# EAGLE design Backplane (EAGLE 9.5.1)
DESIGNER: Hendrik Melse; PART_NUMBER: 68-0005; PROJECT: CougSat-1: Backplane; REV: 3.2.1

## Sheet 1 of 5
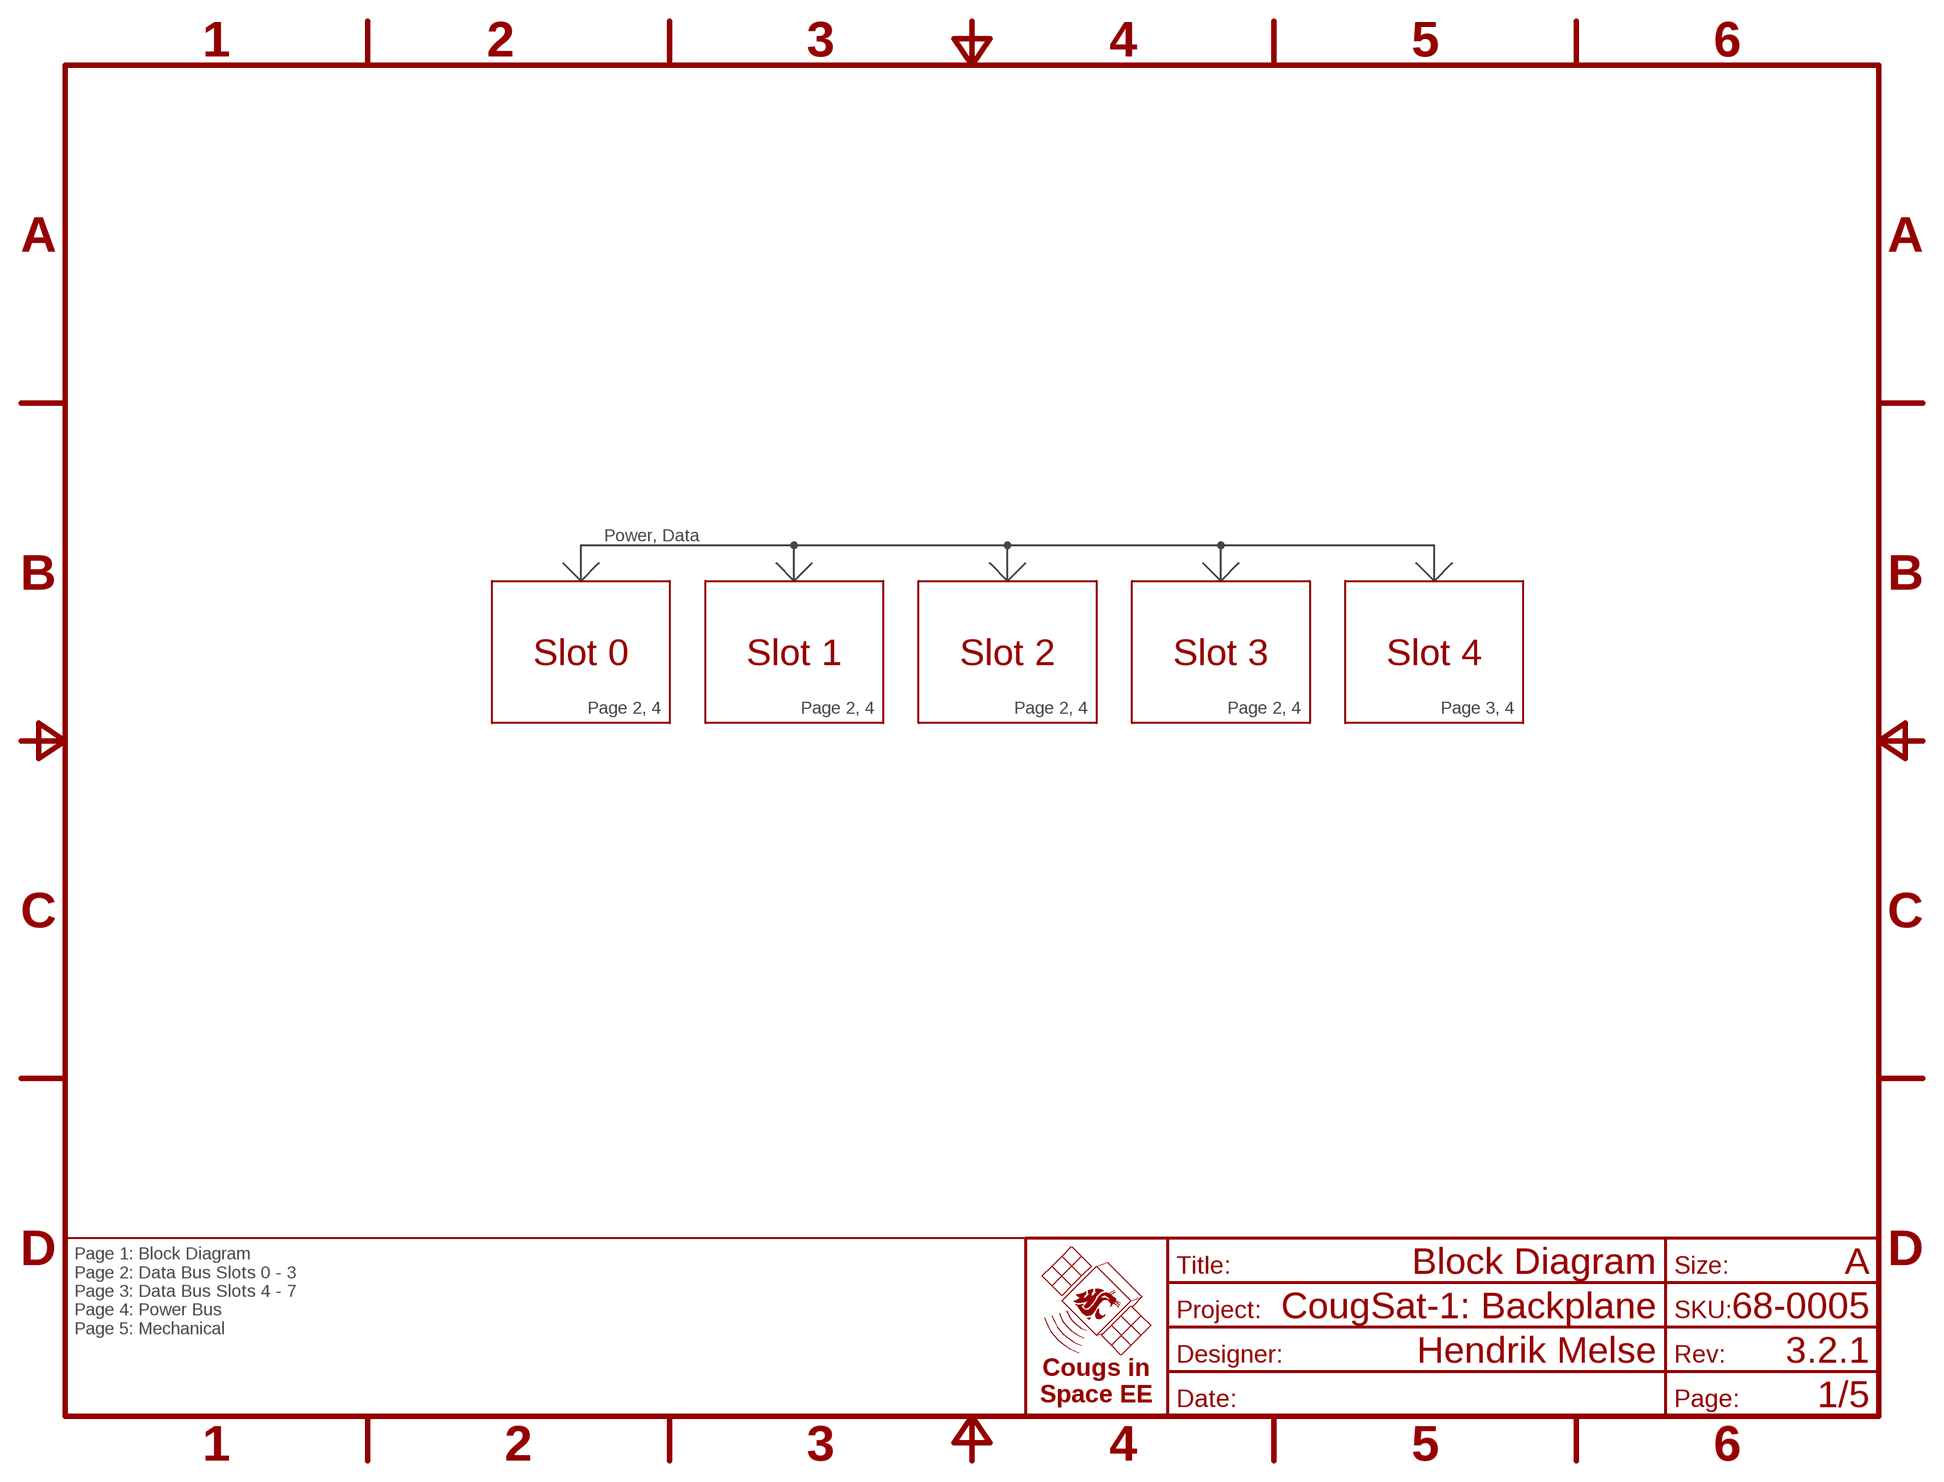
[diagram p0: schematic, sheet 1]
FRAME2 (FRAME-A): TITLE: Block Diagram

### Notes on the sheet
- Power, Data
- Slot 0 | Slot 1 | Slot 2 | Slot 3 | Slot 4
- Page 2, 4 | Page 2, 4 | Page 2, 4 | Page 2, 4 | Page 3, 4
- Page 1: Block Diagram
  Page 2: Data Bus Slots 0 - 3
  Page 3: Data Bus Slots 4 - 7
  Page 4: Power Bus
  Page 5: Mechanical

## Sheet 2 of 5
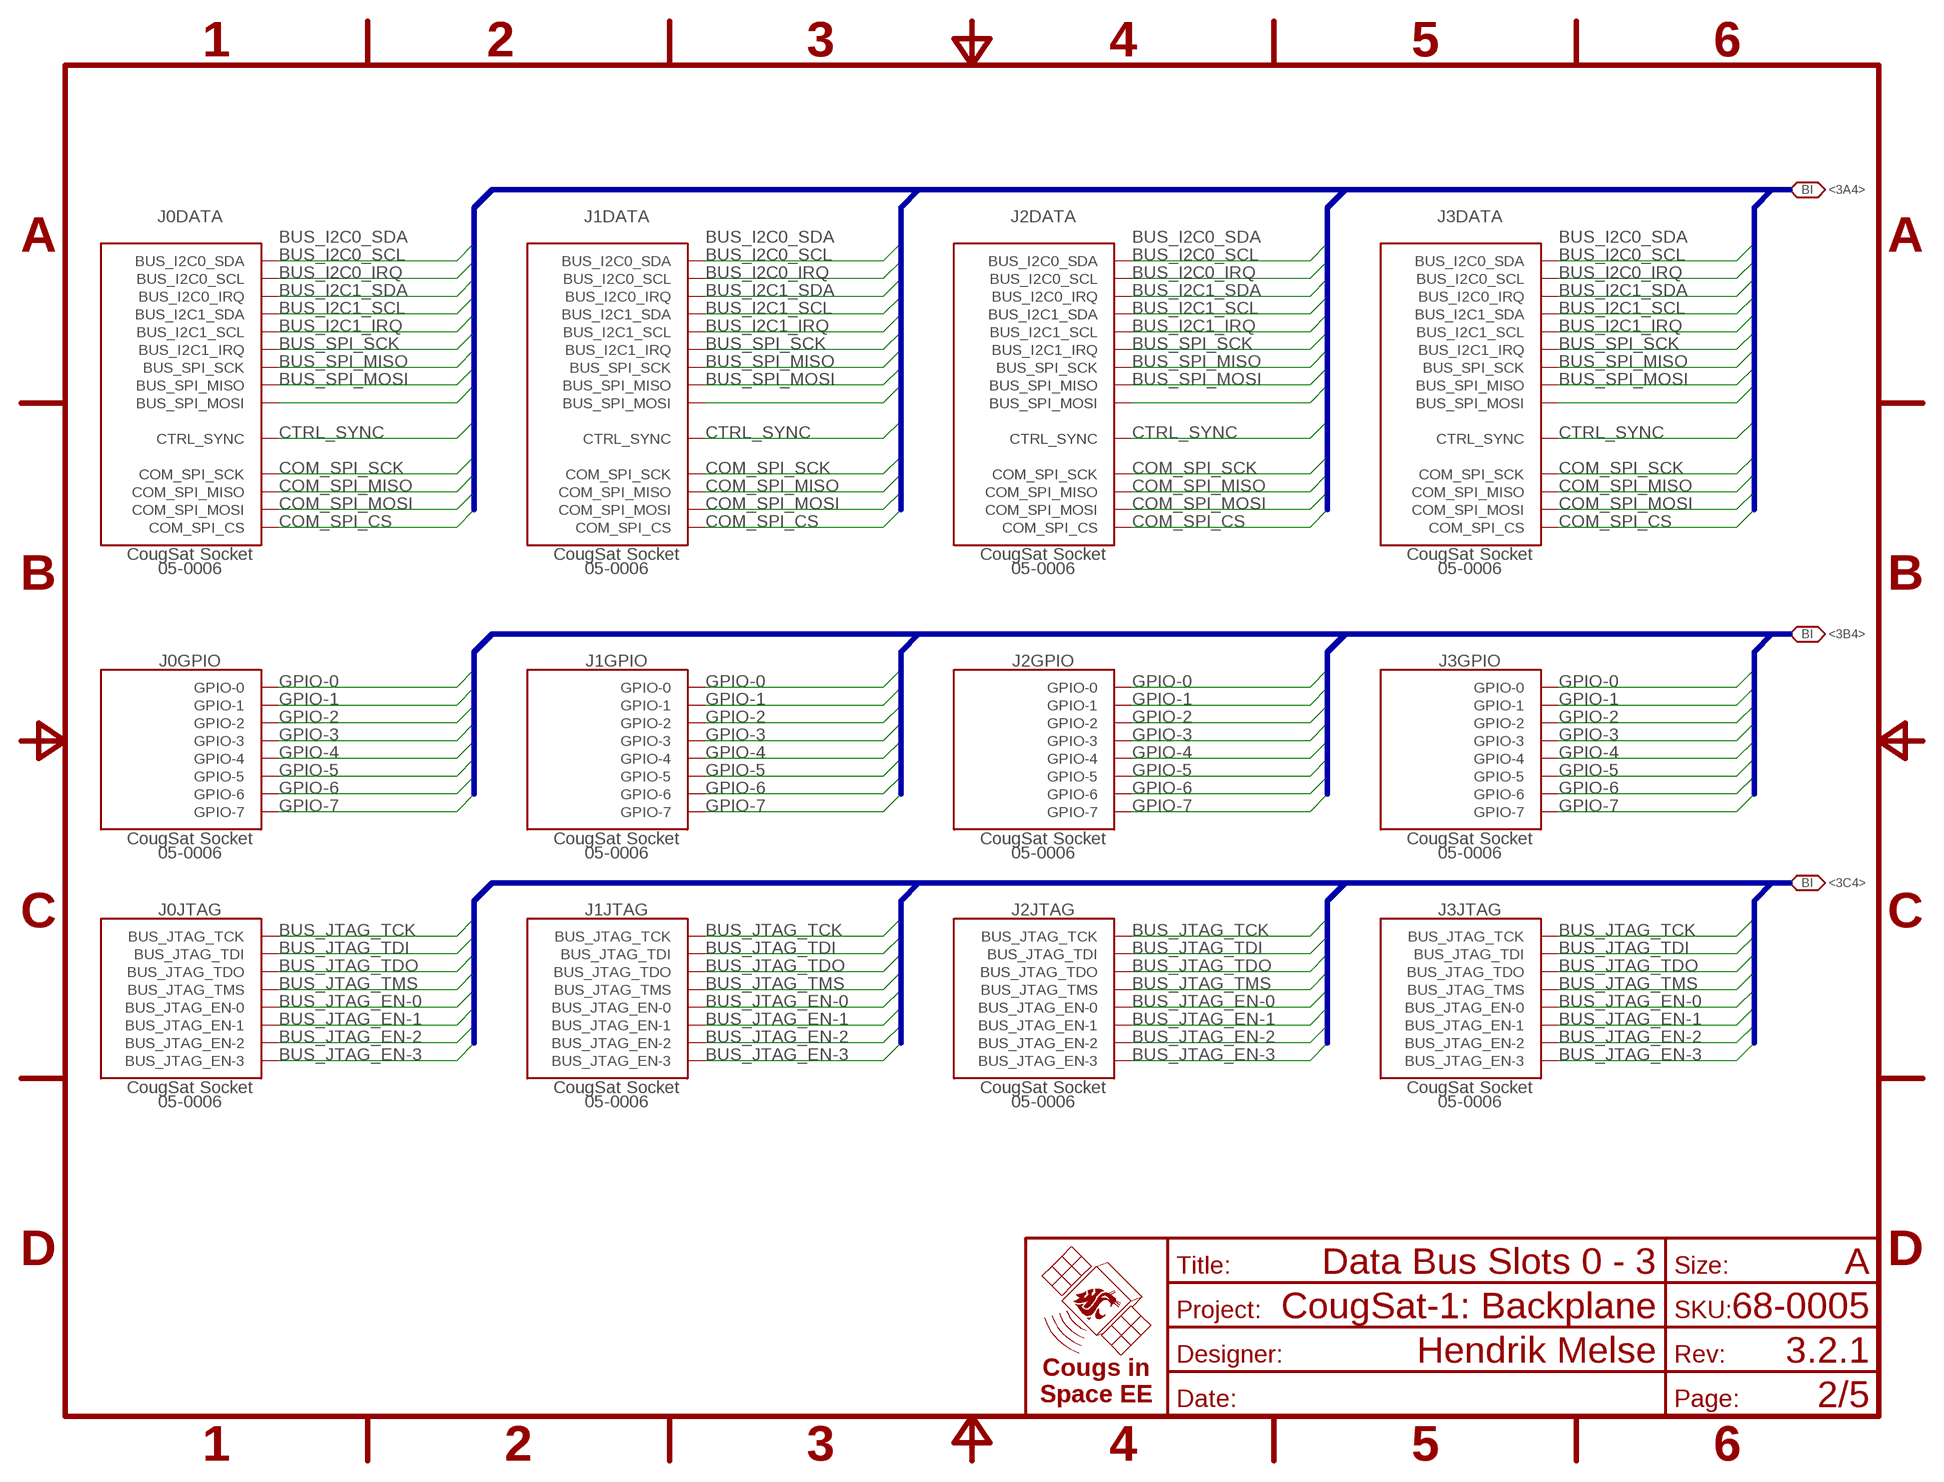
[diagram p1: schematic, sheet 2]
FRAME1 (FRAME-A): TITLE: Data Bus Slots 0 - 3

### Parts
J0  CougSat Socket  CIS_CARD-PCIE  [PCIE-8]
J1  CougSat Socket  CIS_CARD-PCIE  [PCIE-8]
J2  CougSat Socket  CIS_CARD-PCIE  [PCIE-8]
J3  CougSat Socket  CIS_CARD-PCIE  [PCIE-8]

### Nets
BUS_I2C0_IRQ: J0.A45(DATA:BUS_I2C0_IRQ) J0.B45(DATA:BUS_I2C0_IRQ) J1.A45(DATA:BUS_I2C0_IRQ) J1.B45(DATA:BUS_I2C0_IRQ) J2.A45(DATA:BUS_I2C0_IRQ) J2.B45(DATA:BUS_I2C0_IRQ) J3.A45(DATA:BUS_I2C0_IRQ) J3.B45(DATA:BUS_I2C0_IRQ) ; also sheet 3
BUS_I2C0_SCL: J0.A44(DATA:BUS_I2C0_SCL) J0.B44(DATA:BUS_I2C0_SCL) J1.A44(DATA:BUS_I2C0_SCL) J1.B44(DATA:BUS_I2C0_SCL) J2.A44(DATA:BUS_I2C0_SCL) J2.B44(DATA:BUS_I2C0_SCL) J3.A44(DATA:BUS_I2C0_SCL) J3.B44(DATA:BUS_I2C0_SCL) ; also sheet 3
BUS_I2C0_SDA: J0.A43(DATA:BUS_I2C0_SDA) J0.B43(DATA:BUS_I2C0_SDA) J1.A43(DATA:BUS_I2C0_SDA) J1.B43(DATA:BUS_I2C0_SDA) J2.A43(DATA:BUS_I2C0_SDA) J2.B43(DATA:BUS_I2C0_SDA) J3.A43(DATA:BUS_I2C0_SDA) J3.B43(DATA:BUS_I2C0_SDA) ; also sheet 3
BUS_I2C1_IRQ: J0.A32(DATA:BUS_I2C1_IRQ) J0.B32(DATA:BUS_I2C1_IRQ) J1.A32(DATA:BUS_I2C1_IRQ) J1.B32(DATA:BUS_I2C1_IRQ) J2.A32(DATA:BUS_I2C1_IRQ) J2.B32(DATA:BUS_I2C1_IRQ) J3.A32(DATA:BUS_I2C1_IRQ) J3.B32(DATA:BUS_I2C1_IRQ) ; also sheet 3
BUS_I2C1_SCL: J0.A31(DATA:BUS_I2C1_SCL) J0.B31(DATA:BUS_I2C1_SCL) J1.A31(DATA:BUS_I2C1_SCL) J1.B31(DATA:BUS_I2C1_SCL) J2.A31(DATA:BUS_I2C1_SCL) J2.B31(DATA:BUS_I2C1_SCL) J3.A31(DATA:BUS_I2C1_SCL) J3.B31(DATA:BUS_I2C1_SCL) ; also sheet 3
BUS_I2C1_SDA: J0.A30(DATA:BUS_I2C1_SDA) J0.B30(DATA:BUS_I2C1_SDA) J1.A30(DATA:BUS_I2C1_SDA) J1.B30(DATA:BUS_I2C1_SDA) J2.A30(DATA:BUS_I2C1_SDA) J2.B30(DATA:BUS_I2C1_SDA) J3.A30(DATA:BUS_I2C1_SDA) J3.B30(DATA:BUS_I2C1_SDA) ; also sheet 3
BUS_JTAG_EN-0: J0.B46(JTAG:BUS_JTAG_EN-0) J1.B46(JTAG:BUS_JTAG_EN-0) J2.B46(JTAG:BUS_JTAG_EN-0) J3.B46(JTAG:BUS_JTAG_EN-0) ; also sheet 3
BUS_JTAG_EN-1: J0.B47(JTAG:BUS_JTAG_EN-1) J1.B47(JTAG:BUS_JTAG_EN-1) J2.B47(JTAG:BUS_JTAG_EN-1) J3.B47(JTAG:BUS_JTAG_EN-1) ; also sheet 3
BUS_JTAG_EN-2: J0.B48(JTAG:BUS_JTAG_EN-2) J1.B48(JTAG:BUS_JTAG_EN-2) J2.B48(JTAG:BUS_JTAG_EN-2) J3.B48(JTAG:BUS_JTAG_EN-2) ; also sheet 3
BUS_JTAG_EN-3: J0.B49(JTAG:BUS_JTAG_EN-3) J1.B49(JTAG:BUS_JTAG_EN-3) J2.B49(JTAG:BUS_JTAG_EN-3) J3.B49(JTAG:BUS_JTAG_EN-3) ; also sheet 3
BUS_JTAG_TCK: J0.A46(JTAG:BUS_JTAG_TCK) J1.A46(JTAG:BUS_JTAG_TCK) J2.A46(JTAG:BUS_JTAG_TCK) J3.A46(JTAG:BUS_JTAG_TCK) ; also sheet 3
BUS_JTAG_TDI: J0.A47(JTAG:BUS_JTAG_TDI) J1.A47(JTAG:BUS_JTAG_TDI) J2.A47(JTAG:BUS_JTAG_TDI) J3.A47(JTAG:BUS_JTAG_TDI) ; also sheet 3
BUS_JTAG_TDO: J0.A48(JTAG:BUS_JTAG_TDO) J1.A48(JTAG:BUS_JTAG_TDO) J2.A48(JTAG:BUS_JTAG_TDO) J3.A48(JTAG:BUS_JTAG_TDO) ; also sheet 3
BUS_JTAG_TMS: J0.A49(JTAG:BUS_JTAG_TMS) J1.A49(JTAG:BUS_JTAG_TMS) J2.A49(JTAG:BUS_JTAG_TMS) J3.A49(JTAG:BUS_JTAG_TMS) ; also sheet 3
BUS_SPI_MISO: J0.A38(DATA:BUS_SPI_MISO) J0.B38(DATA:BUS_SPI_MISO) J1.A38(DATA:BUS_SPI_MISO) J1.B38(DATA:BUS_SPI_MISO) J2.A38(DATA:BUS_SPI_MISO) J2.B38(DATA:BUS_SPI_MISO) J3.A38(DATA:BUS_SPI_MISO) J3.B38(DATA:BUS_SPI_MISO) ; also sheet 3
BUS_SPI_MOSI: J0.A39(DATA:BUS_SPI_MOSI) J0.B39(DATA:BUS_SPI_MOSI) J1.A39(DATA:BUS_SPI_MOSI) J1.B39(DATA:BUS_SPI_MOSI) J2.A39(DATA:BUS_SPI_MOSI) J2.B39(DATA:BUS_SPI_MOSI) J3.A39(DATA:BUS_SPI_MOSI) J3.B39(DATA:BUS_SPI_MOSI) ; also sheet 3
BUS_SPI_SCK: J0.A37(DATA:BUS_SPI_SCK) J0.B37(DATA:BUS_SPI_SCK) J1.A37(DATA:BUS_SPI_SCK) J1.B37(DATA:BUS_SPI_SCK) J2.A37(DATA:BUS_SPI_SCK) J2.B37(DATA:BUS_SPI_SCK) J3.A37(DATA:BUS_SPI_SCK) J3.B37(DATA:BUS_SPI_SCK) ; also sheet 3
COM_SPI_CS: J0.A36(DATA:COM_SPI_CS) J0.B36(DATA:COM_SPI_CS) J1.A36(DATA:COM_SPI_CS) J1.B36(DATA:COM_SPI_CS) J2.A36(DATA:COM_SPI_CS) J2.B36(DATA:COM_SPI_CS) J3.A36(DATA:COM_SPI_CS) J3.B36(DATA:COM_SPI_CS) ; also sheet 3
COM_SPI_MISO: J0.A34(DATA:COM_SPI_MISO) J0.B34(DATA:COM_SPI_MISO) J1.A34(DATA:COM_SPI_MISO) J1.B34(DATA:COM_SPI_MISO) J2.A34(DATA:COM_SPI_MISO) J2.B34(DATA:COM_SPI_MISO) J3.A34(DATA:COM_SPI_MISO) J3.B34(DATA:COM_SPI_MISO) ; also sheet 3
COM_SPI_MOSI: J0.A35(DATA:COM_SPI_MOSI) J0.B35(DATA:COM_SPI_MOSI) J1.A35(DATA:COM_SPI_MOSI) J1.B35(DATA:COM_SPI_MOSI) J2.A35(DATA:COM_SPI_MOSI) J2.B35(DATA:COM_SPI_MOSI) J3.A35(DATA:COM_SPI_MOSI) J3.B35(DATA:COM_SPI_MOSI) ; also sheet 3
COM_SPI_SCK: J0.A33(DATA:COM_SPI_SCK) J0.B33(DATA:COM_SPI_SCK) J1.A33(DATA:COM_SPI_SCK) J1.B33(DATA:COM_SPI_SCK) J2.A33(DATA:COM_SPI_SCK) J2.B33(DATA:COM_SPI_SCK) J3.A33(DATA:COM_SPI_SCK) J3.B33(DATA:COM_SPI_SCK) ; also sheet 3
CTRL_SYNC: J0.A42(DATA:CTRL_SYNC) J0.B42(DATA:CTRL_SYNC) J1.A42(DATA:CTRL_SYNC) J1.B42(DATA:CTRL_SYNC) J2.A42(DATA:CTRL_SYNC) J2.B42(DATA:CTRL_SYNC) J3.A42(DATA:CTRL_SYNC) J3.B42(DATA:CTRL_SYNC) ; also sheet 3
GPIO-0: J0.A24(GPIO:GPIO-0) J1.A24(GPIO:GPIO-0) J2.A24(GPIO:GPIO-0) J3.A24(GPIO:GPIO-0) ; also sheet 3
GPIO-1: J0.A25(GPIO:GPIO-1) J1.A25(GPIO:GPIO-1) J2.A25(GPIO:GPIO-1) J3.A25(GPIO:GPIO-1) ; also sheet 3
GPIO-2: J0.A26(GPIO:GPIO-2) J1.A26(GPIO:GPIO-2) J2.A26(GPIO:GPIO-2) J3.A26(GPIO:GPIO-2) ; also sheet 3
GPIO-3: J0.A27(GPIO:GPIO-3) J1.A27(GPIO:GPIO-3) J2.A27(GPIO:GPIO-3) J3.A27(GPIO:GPIO-3) ; also sheet 3
GPIO-4: J0.A28(GPIO:GPIO-4) J1.A28(GPIO:GPIO-4) J2.A28(GPIO:GPIO-4) J3.A28(GPIO:GPIO-4) ; also sheet 3
GPIO-5: J0.A29(GPIO:GPIO-5) J1.A29(GPIO:GPIO-5) J2.A29(GPIO:GPIO-5) J3.A29(GPIO:GPIO-5) ; also sheet 3
GPIO-6: J0.A41(GPIO:GPIO-6) J1.A41(GPIO:GPIO-6) J2.A41(GPIO:GPIO-6) J3.A41(GPIO:GPIO-6) ; also sheet 3
GPIO-7: J0.B41(GPIO:GPIO-7) J1.B41(GPIO:GPIO-7) J2.B41(GPIO:GPIO-7) J3.B41(GPIO:GPIO-7) ; also sheet 3

### Buses
BUS_JTAG_EN-[0..3],BUS_JTAG_TCK,BUS_JTAG_TDI,BUS_JTAG_TDO,BUS_JTAG_TMS
GPIO-[0..7]
BUS_I2C0_IRQ,BUS_I2C0_SCL,BUS_I2C0_SDA,BUS_I2C1_IRQ,BUS_I2C1_SCL,BUS_I2C1_SDA,BUS_SPI_MISO,BUS_SPI_MOSI,BUS_SPI_SCK,COM_SPI_CS,COM_SPI_MISO,COM_SPI_MOSI,COM_SPI_SCK,CTRL_SYNC

### Notes on the sheet
- <3A4>
- <3B4>
- <3C4>

## Sheet 3 of 5
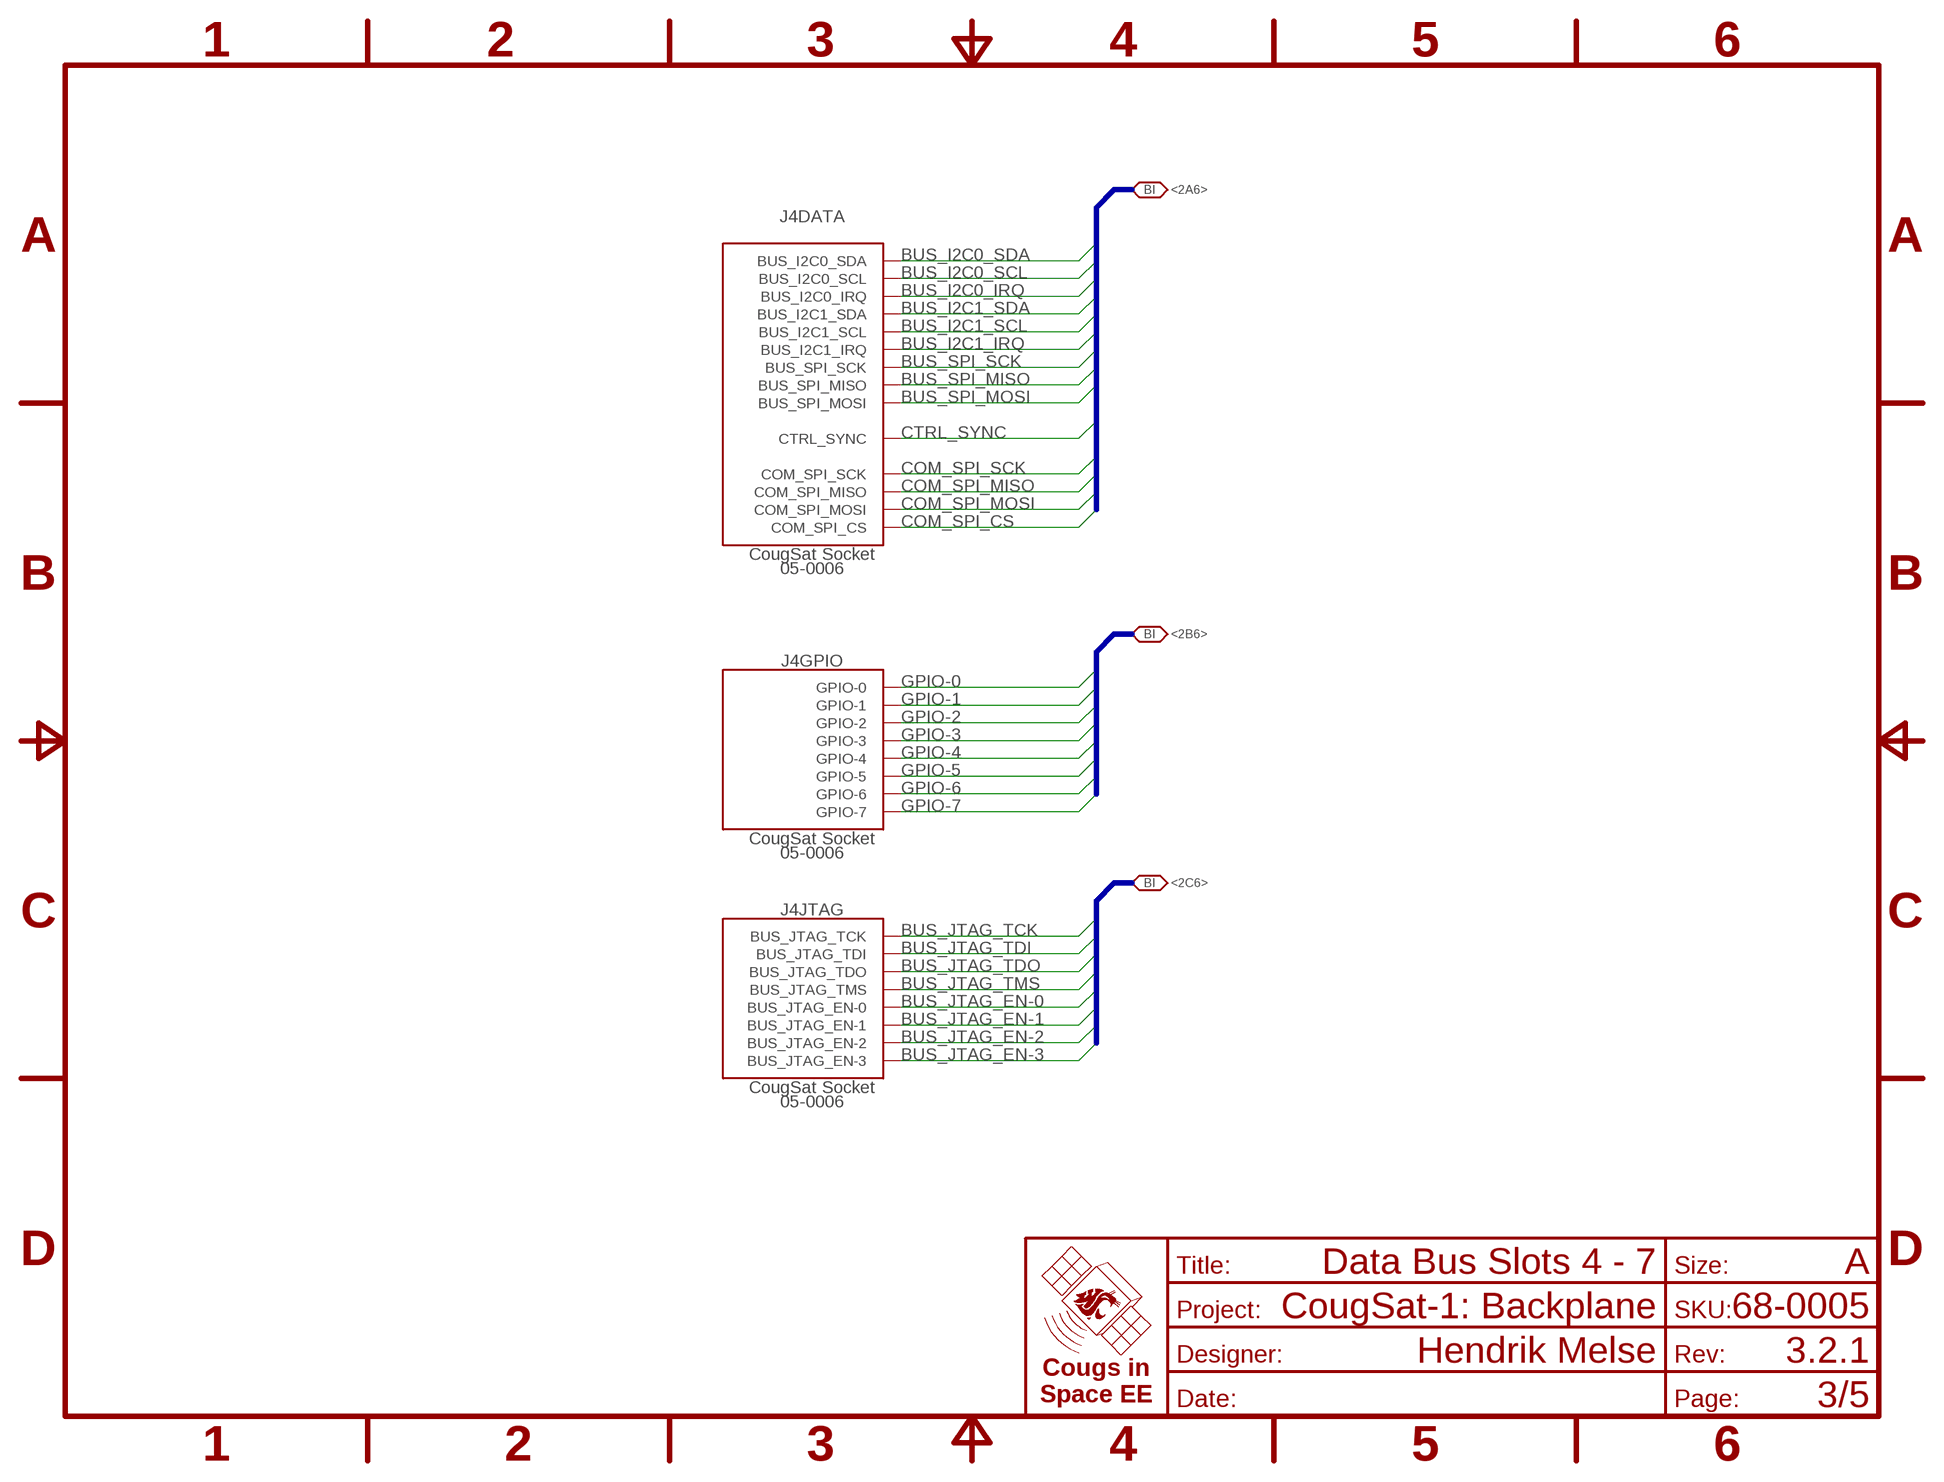
[diagram p2: schematic, sheet 3]
FRAME4 (FRAME-A): TITLE: Data Bus Slots 4 - 7

### Parts
J4  CougSat Socket  CIS_CARD-PCIE  [PCIE-8]

### Nets
BUS_I2C0_IRQ: J4.A45(DATA:BUS_I2C0_IRQ) J4.B45(DATA:BUS_I2C0_IRQ) ; also sheet 2
BUS_I2C0_SCL: J4.A44(DATA:BUS_I2C0_SCL) J4.B44(DATA:BUS_I2C0_SCL) ; also sheet 2
BUS_I2C0_SDA: J4.A43(DATA:BUS_I2C0_SDA) J4.B43(DATA:BUS_I2C0_SDA) ; also sheet 2
BUS_I2C1_IRQ: J4.A32(DATA:BUS_I2C1_IRQ) J4.B32(DATA:BUS_I2C1_IRQ) ; also sheet 2
BUS_I2C1_SCL: J4.A31(DATA:BUS_I2C1_SCL) J4.B31(DATA:BUS_I2C1_SCL) ; also sheet 2
BUS_I2C1_SDA: J4.A30(DATA:BUS_I2C1_SDA) J4.B30(DATA:BUS_I2C1_SDA) ; also sheet 2
BUS_JTAG_EN-0: J4.B46(JTAG:BUS_JTAG_EN-0) ; also sheet 2
BUS_JTAG_EN-1: J4.B47(JTAG:BUS_JTAG_EN-1) ; also sheet 2
BUS_JTAG_EN-2: J4.B48(JTAG:BUS_JTAG_EN-2) ; also sheet 2
BUS_JTAG_EN-3: J4.B49(JTAG:BUS_JTAG_EN-3) ; also sheet 2
BUS_JTAG_TCK: J4.A46(JTAG:BUS_JTAG_TCK) ; also sheet 2
BUS_JTAG_TDI: J4.A47(JTAG:BUS_JTAG_TDI) ; also sheet 2
BUS_JTAG_TDO: J4.A48(JTAG:BUS_JTAG_TDO) ; also sheet 2
BUS_JTAG_TMS: J4.A49(JTAG:BUS_JTAG_TMS) ; also sheet 2
BUS_SPI_MISO: J4.A38(DATA:BUS_SPI_MISO) J4.B38(DATA:BUS_SPI_MISO) ; also sheet 2
BUS_SPI_MOSI: J4.A39(DATA:BUS_SPI_MOSI) J4.B39(DATA:BUS_SPI_MOSI) ; also sheet 2
BUS_SPI_SCK: J4.A37(DATA:BUS_SPI_SCK) J4.B37(DATA:BUS_SPI_SCK) ; also sheet 2
COM_SPI_CS: J4.A36(DATA:COM_SPI_CS) J4.B36(DATA:COM_SPI_CS) ; also sheet 2
COM_SPI_MISO: J4.A34(DATA:COM_SPI_MISO) J4.B34(DATA:COM_SPI_MISO) ; also sheet 2
COM_SPI_MOSI: J4.A35(DATA:COM_SPI_MOSI) J4.B35(DATA:COM_SPI_MOSI) ; also sheet 2
COM_SPI_SCK: J4.A33(DATA:COM_SPI_SCK) J4.B33(DATA:COM_SPI_SCK) ; also sheet 2
CTRL_SYNC: J4.A42(DATA:CTRL_SYNC) J4.B42(DATA:CTRL_SYNC) ; also sheet 2
GPIO-0: J4.A24(GPIO:GPIO-0) ; also sheet 2
GPIO-1: J4.A25(GPIO:GPIO-1) ; also sheet 2
GPIO-2: J4.A26(GPIO:GPIO-2) ; also sheet 2
GPIO-3: J4.A27(GPIO:GPIO-3) ; also sheet 2
GPIO-4: J4.A28(GPIO:GPIO-4) ; also sheet 2
GPIO-5: J4.A29(GPIO:GPIO-5) ; also sheet 2
GPIO-6: J4.A41(GPIO:GPIO-6) ; also sheet 2
GPIO-7: J4.B41(GPIO:GPIO-7) ; also sheet 2

### Buses
BUS_I2C0_IRQ,BUS_I2C0_SCL,BUS_I2C0_SDA,BUS_I2C1_IRQ,BUS_I2C1_SCL,BUS_I2C1_SDA,BUS_SPI_MISO,BUS_SPI_MOSI,BUS_SPI_SCK,COM_SPI_CS,COM_SPI_MISO,COM_SPI_MOSI,COM_SPI_SCK,CTRL_SYNC
BUS_JTAG_EN-[0..3],BUS_JTAG_TCK,BUS_JTAG_TDI,BUS_JTAG_TDO,BUS_JTAG_TMS
GPIO-[0..7]

### Notes on the sheet
- <2A6>
- <2B6>
- <2C6>

## Sheet 4 of 5
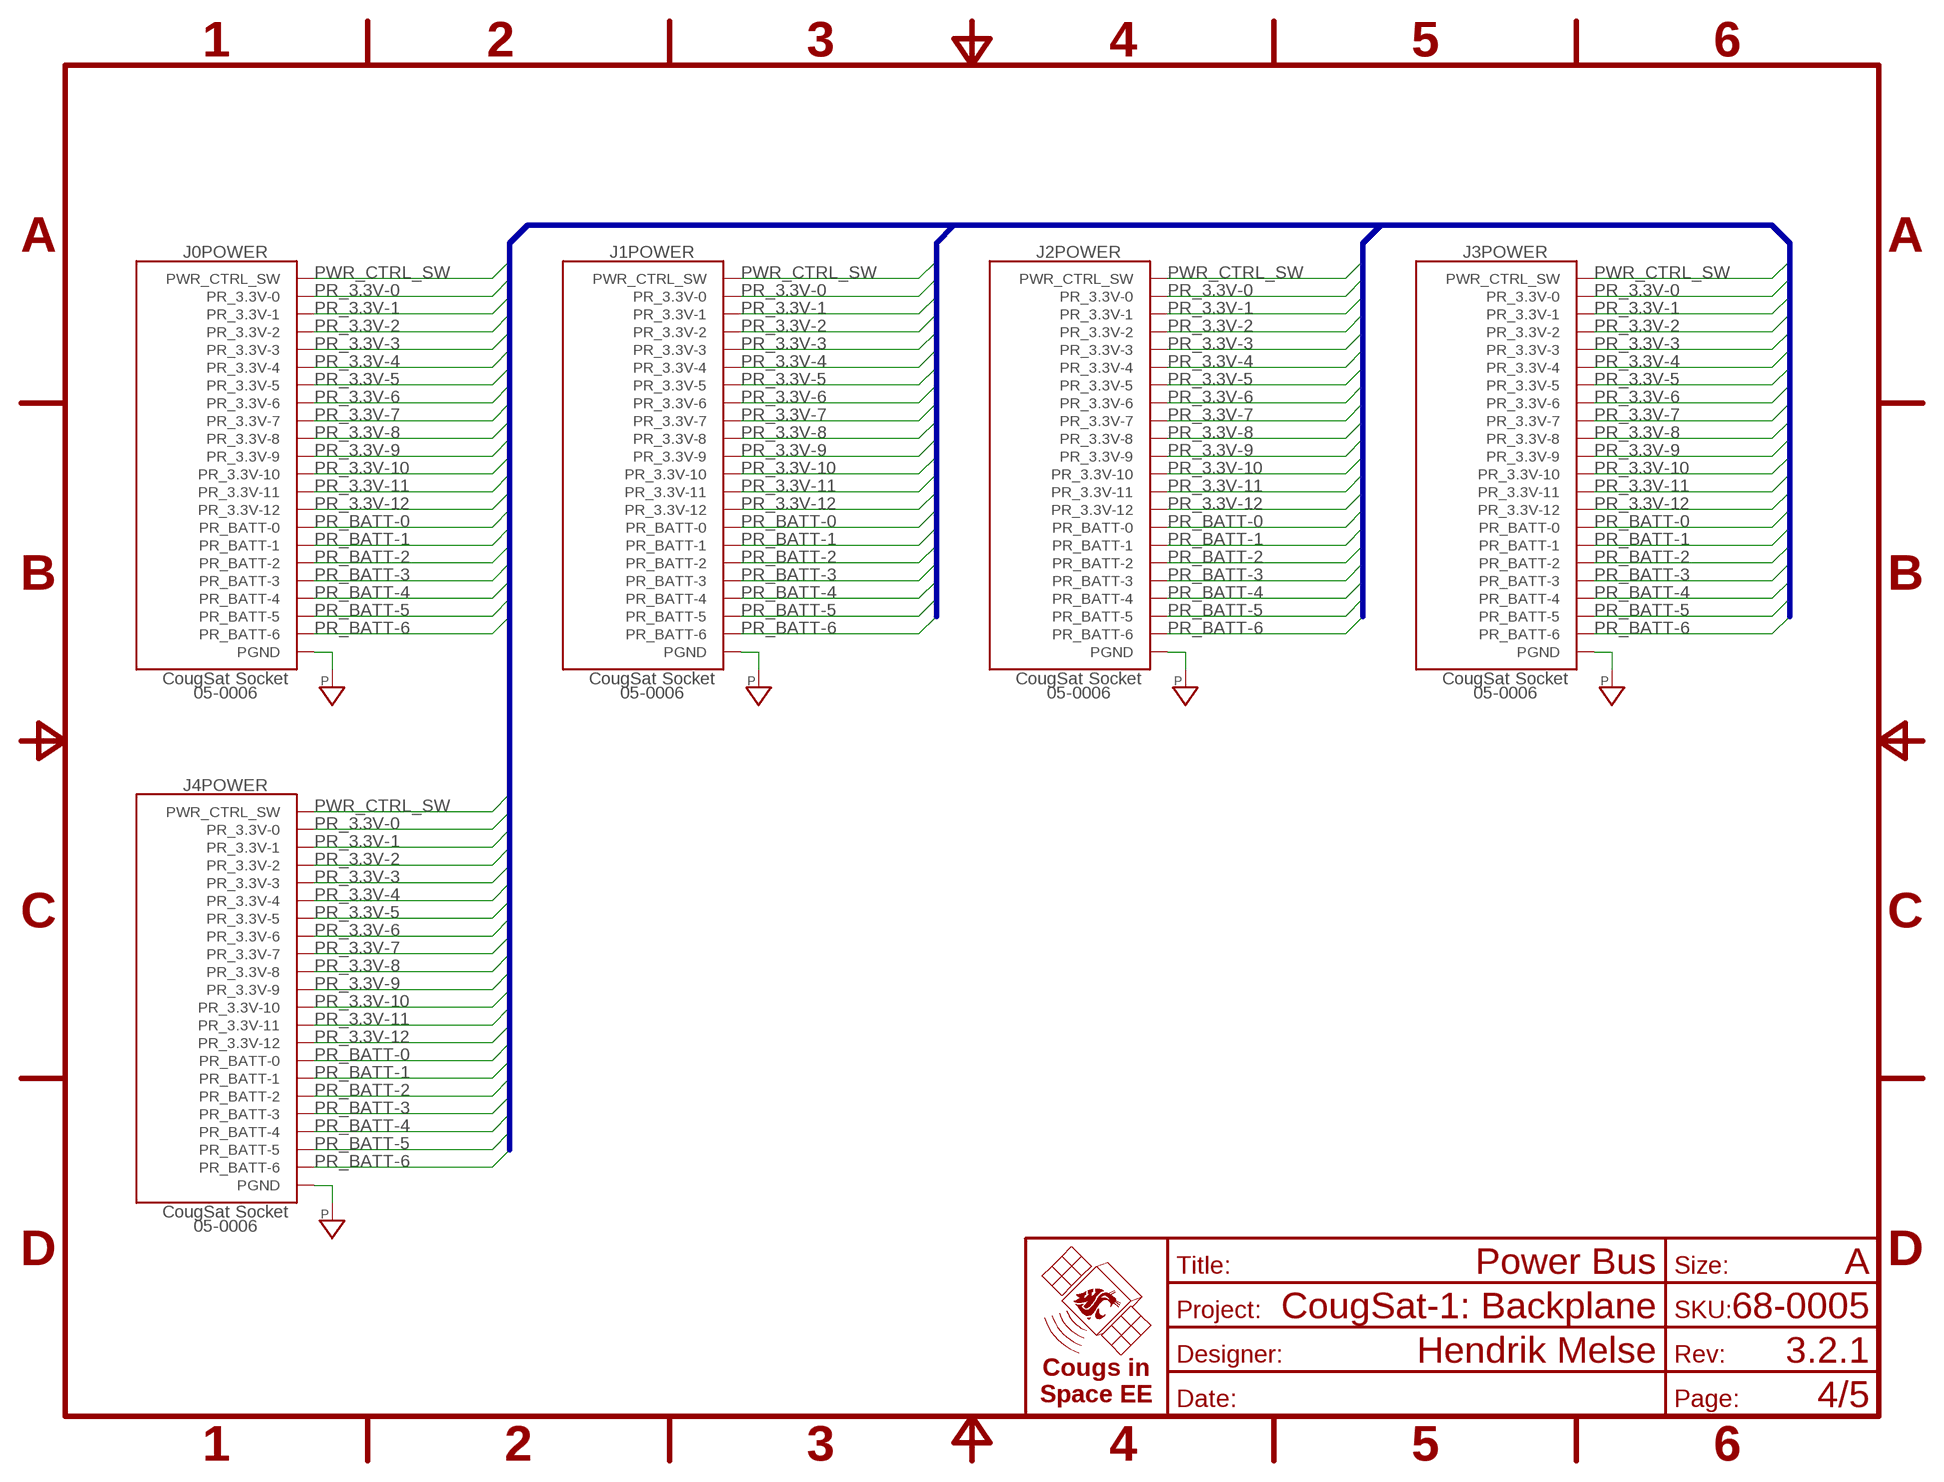
[diagram p3: schematic, sheet 4]
FRAME3 (FRAME-A): TITLE: Power Bus

### Nets
PGND: J0.A21(POWER:PGND) J0.A22(POWER:PGND) J0.A23(POWER:PGND) J0.B21(POWER:PGND) J0.B22(POWER:PGND) J0.B23(POWER:PGND) J0.B24(POWER:PGND) J0.B25(POWER:PGND) J0.B26(POWER:PGND) J0.B27(POWER:PGND) J0.B28(POWER:PGND) J0.B29(POWER:PGND) J1.A21(POWER:PGND) J1.A22(POWER:PGND) J1.A23(POWER:PGND) J1.B21(POWER:PGND) J1.B22(POWER:PGND) J1.B23(POWER:PGND) J1.B24(POWER:PGND) J1.B25(POWER:PGND) J1.B26(POWER:PGND) J1.B27(POWER:PGND) J1.B28(POWER:PGND) J1.B29(POWER:PGND) J2.A21(POWER:PGND) J2.A22(POWER:PGND) J2.A23(POWER:PGND) J2.B21(POWER:PGND) J2.B22(POWER:PGND) J2.B23(POWER:PGND) J2.B24(POWER:PGND) J2.B25(POWER:PGND) J2.B26(POWER:PGND) J2.B27(POWER:PGND) J2.B28(POWER:PGND) J2.B29(POWER:PGND) J3.A21(POWER:PGND) J3.A22(POWER:PGND) J3.A23(POWER:PGND) J3.B21(POWER:PGND) J3.B22(POWER:PGND) J3.B23(POWER:PGND) J3.B24(POWER:PGND) J3.B25(POWER:PGND) J3.B26(POWER:PGND) J3.B27(POWER:PGND) J3.B28(POWER:PGND) J3.B29(POWER:PGND) J4.A21(POWER:PGND) J4.A22(POWER:PGND) J4.A23(POWER:PGND) J4.B21(POWER:PGND) J4.B22(POWER:PGND) J4.B23(POWER:PGND) J4.B24(POWER:PGND) J4.B25(POWER:PGND) J4.B26(POWER:PGND) J4.B27(POWER:PGND) J4.B28(POWER:PGND) J4.B29(POWER:PGND) ; also sheet 5
PR_3.3V-0: J0.A1(POWER:PR_3.3V-0) J0.B1(POWER:PR_3.3V-0) J1.A1(POWER:PR_3.3V-0) J1.B1(POWER:PR_3.3V-0) J2.A1(POWER:PR_3.3V-0) J2.B1(POWER:PR_3.3V-0) J3.A1(POWER:PR_3.3V-0) J3.B1(POWER:PR_3.3V-0) J4.A1(POWER:PR_3.3V-0) J4.B1(POWER:PR_3.3V-0)
PR_3.3V-1: J0.A2(POWER:PR_3.3V-1) J0.B2(POWER:PR_3.3V-1) J1.A2(POWER:PR_3.3V-1) J1.B2(POWER:PR_3.3V-1) J2.A2(POWER:PR_3.3V-1) J2.B2(POWER:PR_3.3V-1) J3.A2(POWER:PR_3.3V-1) J3.B2(POWER:PR_3.3V-1) J4.A2(POWER:PR_3.3V-1) J4.B2(POWER:PR_3.3V-1)
PR_3.3V-2: J0.A3(POWER:PR_3.3V-2) J0.B3(POWER:PR_3.3V-2) J1.A3(POWER:PR_3.3V-2) J1.B3(POWER:PR_3.3V-2) J2.A3(POWER:PR_3.3V-2) J2.B3(POWER:PR_3.3V-2) J3.A3(POWER:PR_3.3V-2) J3.B3(POWER:PR_3.3V-2) J4.A3(POWER:PR_3.3V-2) J4.B3(POWER:PR_3.3V-2)
PR_3.3V-3: J0.A4(POWER:PR_3.3V-3) J0.B4(POWER:PR_3.3V-3) J1.A4(POWER:PR_3.3V-3) J1.B4(POWER:PR_3.3V-3) J2.A4(POWER:PR_3.3V-3) J2.B4(POWER:PR_3.3V-3) J3.A4(POWER:PR_3.3V-3) J3.B4(POWER:PR_3.3V-3) J4.A4(POWER:PR_3.3V-3) J4.B4(POWER:PR_3.3V-3)
PR_3.3V-4: J0.A5(POWER:PR_3.3V-4) J0.B5(POWER:PR_3.3V-4) J1.A5(POWER:PR_3.3V-4) J1.B5(POWER:PR_3.3V-4) J2.A5(POWER:PR_3.3V-4) J2.B5(POWER:PR_3.3V-4) J3.A5(POWER:PR_3.3V-4) J3.B5(POWER:PR_3.3V-4) J4.A5(POWER:PR_3.3V-4) J4.B5(POWER:PR_3.3V-4)
PR_3.3V-5: J0.A6(POWER:PR_3.3V-5) J0.B6(POWER:PR_3.3V-5) J1.A6(POWER:PR_3.3V-5) J1.B6(POWER:PR_3.3V-5) J2.A6(POWER:PR_3.3V-5) J2.B6(POWER:PR_3.3V-5) J3.A6(POWER:PR_3.3V-5) J3.B6(POWER:PR_3.3V-5) J4.A6(POWER:PR_3.3V-5) J4.B6(POWER:PR_3.3V-5)
PR_3.3V-6: J0.A7(POWER:PR_3.3V-6) J0.B7(POWER:PR_3.3V-6) J1.A7(POWER:PR_3.3V-6) J1.B7(POWER:PR_3.3V-6) J2.A7(POWER:PR_3.3V-6) J2.B7(POWER:PR_3.3V-6) J3.A7(POWER:PR_3.3V-6) J3.B7(POWER:PR_3.3V-6) J4.A7(POWER:PR_3.3V-6) J4.B7(POWER:PR_3.3V-6)
PR_3.3V-7: J0.A8(POWER:PR_3.3V-7) J0.B8(POWER:PR_3.3V-7) J1.A8(POWER:PR_3.3V-7) J1.B8(POWER:PR_3.3V-7) J2.A8(POWER:PR_3.3V-7) J2.B8(POWER:PR_3.3V-7) J3.A8(POWER:PR_3.3V-7) J3.B8(POWER:PR_3.3V-7) J4.A8(POWER:PR_3.3V-7) J4.B8(POWER:PR_3.3V-7)
PR_3.3V-8: J0.A9(POWER:PR_3.3V-8) J0.B9(POWER:PR_3.3V-8) J1.A9(POWER:PR_3.3V-8) J1.B9(POWER:PR_3.3V-8) J2.A9(POWER:PR_3.3V-8) J2.B9(POWER:PR_3.3V-8) J3.A9(POWER:PR_3.3V-8) J3.B9(POWER:PR_3.3V-8) J4.A9(POWER:PR_3.3V-8) J4.B9(POWER:PR_3.3V-8)
PR_3.3V-9: J0.A10(POWER:PR_3.3V-9) J0.B10(POWER:PR_3.3V-9) J1.A10(POWER:PR_3.3V-9) J1.B10(POWER:PR_3.3V-9) J2.A10(POWER:PR_3.3V-9) J2.B10(POWER:PR_3.3V-9) J3.A10(POWER:PR_3.3V-9) J3.B10(POWER:PR_3.3V-9) J4.A10(POWER:PR_3.3V-9) J4.B10(POWER:PR_3.3V-9)
PR_3.3V-10: J0.A11(POWER:PR_3.3V-10) J0.B11(POWER:PR_3.3V-10) J1.A11(POWER:PR_3.3V-10) J1.B11(POWER:PR_3.3V-10) J2.A11(POWER:PR_3.3V-10) J2.B11(POWER:PR_3.3V-10) J3.A11(POWER:PR_3.3V-10) J3.B11(POWER:PR_3.3V-10) J4.A11(POWER:PR_3.3V-10) J4.B11(POWER:PR_3.3V-10)
PR_3.3V-11: J0.A12(POWER:PR_3.3V-11) J0.B12(POWER:PR_3.3V-11) J1.A12(POWER:PR_3.3V-11) J1.B12(POWER:PR_3.3V-11) J2.A12(POWER:PR_3.3V-11) J2.B12(POWER:PR_3.3V-11) J3.A12(POWER:PR_3.3V-11) J3.B12(POWER:PR_3.3V-11) J4.A12(POWER:PR_3.3V-11) J4.B12(POWER:PR_3.3V-11)
PR_3.3V-12: J0.A13(POWER:PR_3.3V-12) J0.B13(POWER:PR_3.3V-12) J1.A13(POWER:PR_3.3V-12) J1.B13(POWER:PR_3.3V-12) J2.A13(POWER:PR_3.3V-12) J2.B13(POWER:PR_3.3V-12) J3.A13(POWER:PR_3.3V-12) J3.B13(POWER:PR_3.3V-12) J4.A13(POWER:PR_3.3V-12) J4.B13(POWER:PR_3.3V-12)
PR_BATT-0: J0.A14(POWER:PR_BATT-0) J0.B14(POWER:PR_BATT-0) J1.A14(POWER:PR_BATT-0) J1.B14(POWER:PR_BATT-0) J2.A14(POWER:PR_BATT-0) J2.B14(POWER:PR_BATT-0) J3.A14(POWER:PR_BATT-0) J3.B14(POWER:PR_BATT-0) J4.A14(POWER:PR_BATT-0) J4.B14(POWER:PR_BATT-0)
PR_BATT-1: J0.A15(POWER:PR_BATT-1) J0.B15(POWER:PR_BATT-1) J1.A15(POWER:PR_BATT-1) J1.B15(POWER:PR_BATT-1) J2.A15(POWER:PR_BATT-1) J2.B15(POWER:PR_BATT-1) J3.A15(POWER:PR_BATT-1) J3.B15(POWER:PR_BATT-1) J4.A15(POWER:PR_BATT-1) J4.B15(POWER:PR_BATT-1)
PR_BATT-2: J0.A16(POWER:PR_BATT-2) J0.B16(POWER:PR_BATT-2) J1.A16(POWER:PR_BATT-2) J1.B16(POWER:PR_BATT-2) J2.A16(POWER:PR_BATT-2) J2.B16(POWER:PR_BATT-2) J3.A16(POWER:PR_BATT-2) J3.B16(POWER:PR_BATT-2) J4.A16(POWER:PR_BATT-2) J4.B16(POWER:PR_BATT-2)
PR_BATT-3: J0.A17(POWER:PR_BATT-3) J0.B17(POWER:PR_BATT-3) J1.A17(POWER:PR_BATT-3) J1.B17(POWER:PR_BATT-3) J2.A17(POWER:PR_BATT-3) J2.B17(POWER:PR_BATT-3) J3.A17(POWER:PR_BATT-3) J3.B17(POWER:PR_BATT-3) J4.A17(POWER:PR_BATT-3) J4.B17(POWER:PR_BATT-3)
PR_BATT-4: J0.A18(POWER:PR_BATT-4) J0.B18(POWER:PR_BATT-4) J1.A18(POWER:PR_BATT-4) J1.B18(POWER:PR_BATT-4) J2.A18(POWER:PR_BATT-4) J2.B18(POWER:PR_BATT-4) J3.A18(POWER:PR_BATT-4) J3.B18(POWER:PR_BATT-4) J4.A18(POWER:PR_BATT-4) J4.B18(POWER:PR_BATT-4)
PR_BATT-5: J0.A19(POWER:PR_BATT-5) J0.B19(POWER:PR_BATT-5) J1.A19(POWER:PR_BATT-5) J1.B19(POWER:PR_BATT-5) J2.A19(POWER:PR_BATT-5) J2.B19(POWER:PR_BATT-5) J3.A19(POWER:PR_BATT-5) J3.B19(POWER:PR_BATT-5) J4.A19(POWER:PR_BATT-5) J4.B19(POWER:PR_BATT-5)
PR_BATT-6: J0.A20(POWER:PR_BATT-6) J0.B20(POWER:PR_BATT-6) J1.A20(POWER:PR_BATT-6) J1.B20(POWER:PR_BATT-6) J2.A20(POWER:PR_BATT-6) J2.B20(POWER:PR_BATT-6) J3.A20(POWER:PR_BATT-6) J3.B20(POWER:PR_BATT-6) J4.A20(POWER:PR_BATT-6) J4.B20(POWER:PR_BATT-6)
PWR_CTRL_SW: J0.A40(POWER:PWR_CTRL_SW) J0.B40(POWER:PWR_CTRL_SW) J1.A40(POWER:PWR_CTRL_SW) J1.B40(POWER:PWR_CTRL_SW) J2.A40(POWER:PWR_CTRL_SW) J2.B40(POWER:PWR_CTRL_SW) J3.A40(POWER:PWR_CTRL_SW) J3.B40(POWER:PWR_CTRL_SW) J4.A40(POWER:PWR_CTRL_SW) J4.B40(POWER:PWR_CTRL_SW)

### Buses
PR_3.3V-[0..12],PR_BATT-[0..6],PWR_CTRL_SW

## Sheet 5 of 5
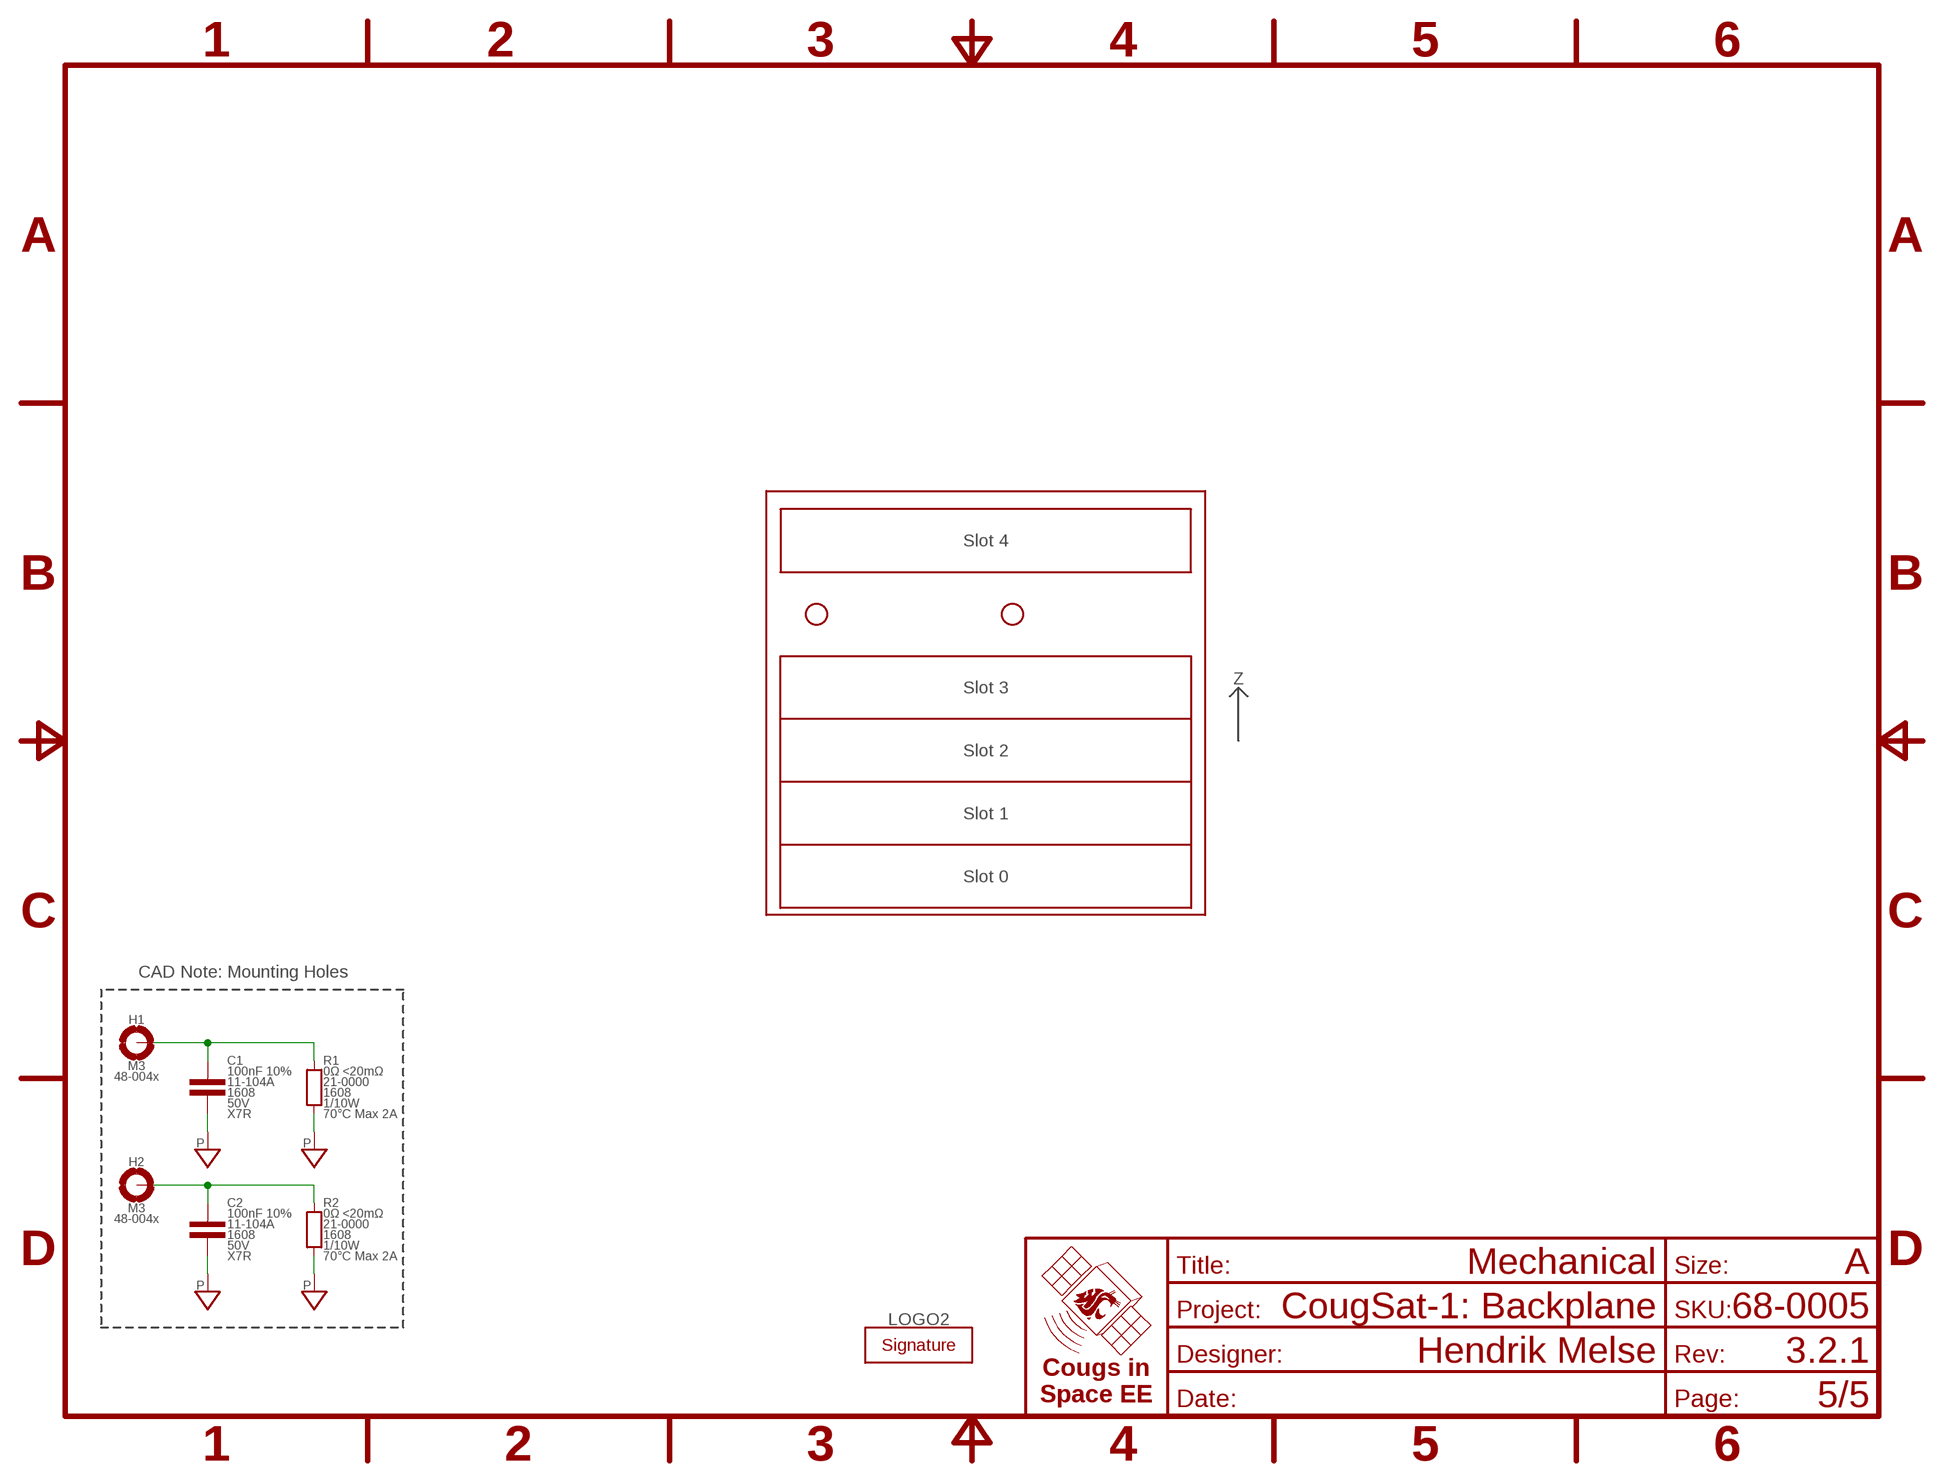
[diagram p4: schematic, sheet 5]
FRAME5 (FRAME-A): TITLE: Mechanical

### Parts
C1  100nF 10%  CAP-V-100NF-1608  [1608]
C2  100nF 10%  CAP-V-100NF-1608  [1608]
H1  M3  MOUNTING_HOLE-3.3  [MOUNTING_HOLE-3.3]
H2  M3  MOUNTING_HOLE-3.3  [MOUNTING_HOLE-3.3]
LOGO2  SIGNATUREHENDRIK  [SIGN-HENDRIK]
R1  0Ω <20mΩ  RES-V-0-1608  [1608]
R2  0Ω <20mΩ  RES-V-0-1608  [1608]

### Nets
CHASSIS1: C1.1 H1.1(MOUNT) H1.V1(MOUNT) H1.V2(MOUNT) H1.V3(MOUNT) H1.V4(MOUNT) H1.V5(MOUNT) H1.V6(MOUNT) H1.V7(MOUNT) H1.V8(MOUNT) H1.V9(MOUNT) H1.V10(MOUNT) R1.2
CHASSIS2: C2.1 H2.1(MOUNT) H2.V1(MOUNT) H2.V2(MOUNT) H2.V3(MOUNT) H2.V4(MOUNT) H2.V5(MOUNT) H2.V6(MOUNT) H2.V7(MOUNT) H2.V8(MOUNT) H2.V9(MOUNT) H2.V10(MOUNT) R2.2
PGND: C1.2 C2.2 R1.1 R2.1 ; also sheet 4

### Notes on the sheet
- Slot 4
- Z
- Slot 3
- Slot 2
- Slot 1
- Slot 0
- CAD Note: Mounting Holes

## Library data of the parts
C1 C2 = CougsInSpace-Capacitors:CAP-V: Capacitor - Vertical Orientation; PACKAGE: 1608; SKU: 11-104A; TEMP: X7R; VOLTAGE: 50V
H1 H2 = CougsInSpace-Hardware:MOUNTING_HOLE: Mounting Hole; SKU: 48-004x
J0 J1-J4 = CougsInSpace-Connectors:CIS_CARD: CougSat Card Socket; SKU: 05-0006
LOGO2 = CougsInSpace-Aesthetics:SIGNATURE: Designer's (Artist's) Signature
R1 R2 = CougsInSpace-Resistors:RES-V: Resistor Vertical; PACKAGE: 1608; POWER: 1/10W; SKU: 21-0000; TEMP: 70°C Max 2A

## Board
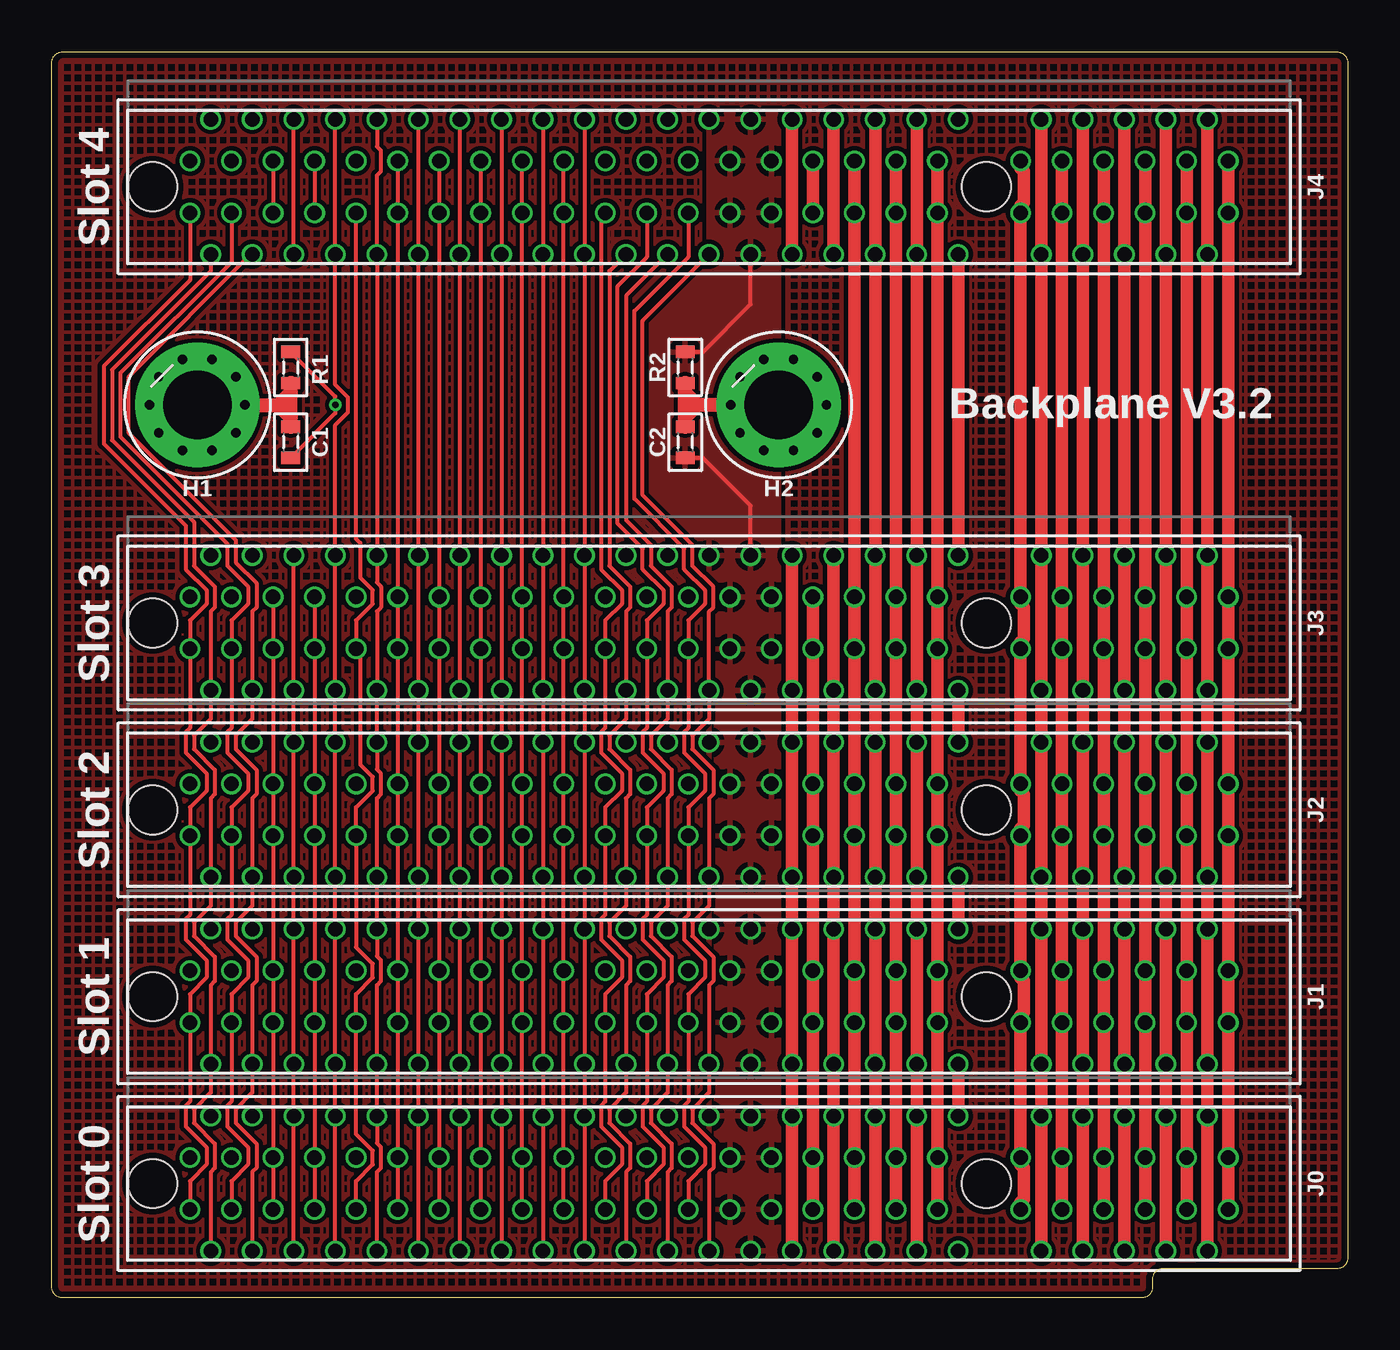
[diagram p5: board, top side]
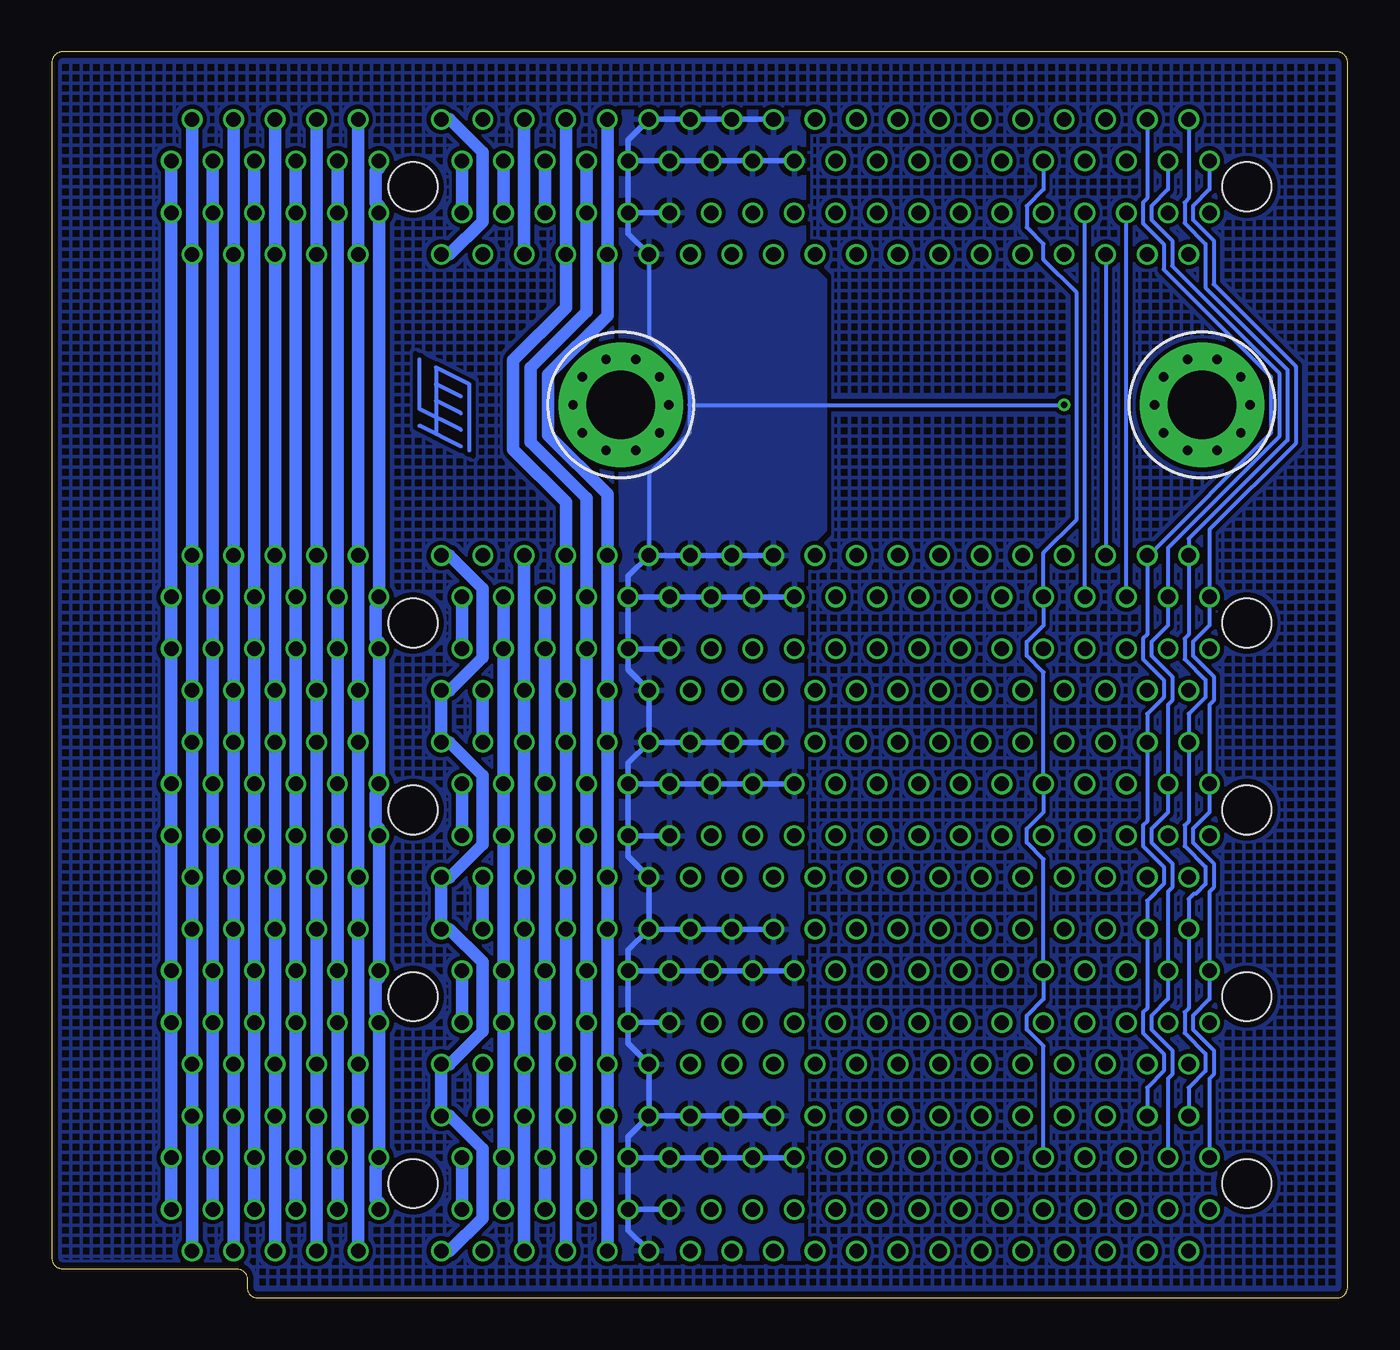
[diagram p6: board, bottom side, seen from below]

Size 62.4 x 60 mm. Coordinates in mm from the lower left corner, seen from the top.
Outline: 0.5,60 61.9,60 arc-90 62.4,59.5 62.4,1.9 arc-90 61.9,1.4 53.5,1.4 arc90 53,0.9 53,0.5 arc-90 52.5,0 0.5,0 arc-90 0,0.5 0,59.5 arc-90 0.5,60
Copper layers (1*16): Top 0.035mm / dielectric 1.6mm / Bottom 0.035mm
Design rules "CougsInSpace *": minimum track width 0.2mm, minimum drill 0.3mm, track to track 0.2mm, track to pad 0.2mm, pad to pad 0.2mm, via to via 0.2mm, smd to smd 0mil, copper to edge 0.3mm, drill to drill 0.3mm, minimum pad ring 0.15mm, minimum via ring 0.15mm, stop-mask expansion 0mil, vias tented up to drill 1mm, thermal gap 0.25mm

### Footprints (pad centres in the part's own frame; a part is rotated, then mirrored left to right if it is on the bottom)
1608 = smd 0.6 x 0.9: 1 -0.75,0; 2 0.75,0
MOUNTING_HOLE-3.3 = drill 3.3 pad 6: 1 0,0 | drill 0.45 pad 0.6: V1 2.3,0; V2 1.861,1.352; V3 0.711,2.187; V4 -0.711,2.187; V5 -1.861,1.352; V6 -2.3,0; V7 -1.861,-1.352; V8 -0.711,-2.187; V9 0.711,-2.187; V10 1.861,-1.352
PCIE-8 = drill 0.7: A1 -11.65,1.25; A2 -10.65,3.25; A3 -9.65,1.25; A4 -8.65,3.25; A5 -7.65,1.25; A6 -6.65,3.25; A7 -5.65,1.25; A8 -4.65,3.25; A9 -3.65,1.25; A10 -2.65,3.25; A11 -1.65,1.25; A12 1.35,3.25; A13 2.35,1.25; A14 3.35,3.25; A15 4.35,1.25; A16 5.35,3.25; A17 6.35,1.25; A18 7.35,3.25; A19 8.35,1.25; A20 9.35,3.25; A21 10.35,1.25; A22 11.35,3.25; A23 12.35,1.25; A24 13.35,3.25; A25 14.35,1.25; A26 15.35,3.25; A27 16.35,1.25; A28 17.35,3.25; A29 18.35,1.25; A30 19.35,3.25; A31 20.35,1.25; A32 21.35,3.25; A33 22.35,1.25; A34 23.35,3.25; A35 24.35,1.25; A36 25.35,3.25; A37 26.35,1.25; A38 27.35,3.25; A39 28.35,1.25; A40 29.35,3.25; A41 30.35,1.25; A42 31.35,3.25; A43 32.35,1.25; A44 33.35,3.25; A45 34.35,1.25; A46 35.35,3.25; A47 36.35,1.25; A48 37.35,3.25; A49 38.35,1.25; B1 -11.65,-1.25; B2 -10.65,-3.25; B3 -9.65,-1.25; B4 -8.65,-3.25; B5 -7.65,-1.25; B6 -6.65,-3.25; B7 -5.65,-1.25; B8 -4.65,-3.25; B9 -3.65,-1.25; B10 -2.65,-3.25; B11 -1.65,-1.25; B12 1.35,-3.25; B13 2.35,-1.25; B14 3.35,-3.25; B15 4.35,-1.25; B16 5.35,-3.25; B17 6.35,-1.25; B18 7.35,-3.25; B19 8.35,-1.25; B20 9.35,-3.25; B21 10.35,-1.25; B22 11.35,-3.25; B23 12.35,-1.25; B24 13.35,-3.25; B25 14.35,-1.25; B26 15.35,-3.25; B27 16.35,-1.25; B28 17.35,-3.25; B29 18.35,-1.25; B30 19.35,-3.25; B31 20.35,-1.25; B32 21.35,-3.25; B33 22.35,-1.25; B34 23.35,-3.25; B35 24.35,-1.25; B36 25.35,-3.25; B37 26.35,-1.25; B38 27.35,-3.25; B39 28.35,-1.25; B40 29.35,-3.25; B41 30.35,-1.25; B42 31.35,-3.25; B43 32.35,-1.25; B44 33.35,-3.25; B45 34.35,-1.25; B46 35.35,-3.25; B47 36.35,-1.25; B48 37.35,-3.25; B49 38.35,-1.25 | hole 2.35: 0,0; 40.15,0

### Placement (x,y rotation side)
C1  11.5,41.2 270 top
C2  30.5,41.2 270 top
H1  7,43 180 top
H2  35,43 180 top
J0  45,5.5 180 top
J1  45,14.5 180 top
J2  45,23.5 180 top
J3  45,32.5 180 top
J4  45,53.5 180 top
LOGO2  43.5,43 90 bottom
R1  11.5,44.8 270 top
R2  30.5,44.8 270 top

### Tracks (layer width: path | path; a pad name or v marks a point on that pad's centre or on a via)
BALANCING-BOTTOM
  pour Bottom (rank 6, hatched): 0,0.5 0,59.5 arc-90 0.5,60 61.9,60 arc-90 62.4,59.5 62.4,1.4 53.5,1.4 arc90 53,0.9 53,0.5 arc-90 52.5,0 0.5,0 arc-90
BALANCING-BOTTOM1
  pour Top (rank 6, hatched): 0,0.5 0,59.5 arc-90 0.5,60 61.9,60 arc-90 62.4,59.5 62.4,1.4 53.5,1.4 arc90 53,0.9 53,0.5 arc-90 52.5,0 0.5,0 arc-90
BUS_I2C0_IRQ
  Top 0.2: J4.B45 J4.A45 | J3.B45 J3.A45 J2.B45 J2.A45 J1.B45 J1.A45 J0.B45 J0.A45
  Bottom 0.2: J3.B45 J4.A45
BUS_I2C0_SCL
  Top 0.2: J0.A44 J0.B44 J1.A44 J1.B44 J2.A44 J2.B44 J3.A44 J3.B44 | J4.A44 J4.B44
  Bottom 0.2: J4.A44 J3.B44
BUS_I2C0_SDA
  Top 0.2: J4.B43 J4.A43 | J3.B43 J3.A43 J2.B43 J2.A43 J1.B43 J1.A43 J0.B43 J0.A43
  Bottom 0.2: J3.B43 J4.A43
BUS_I2C1_IRQ
  Top 0.2: J4.B32 J4.A32 J3.B32 J3.A32 J2.B32 J2.A32 J1.B32 J1.A32 J0.B32 J0.A32
BUS_I2C1_SCL
  Top 0.2: J0.A31 J0.B31 J1.A31 J1.B31 J2.A31 J2.B31 J3.A31 J3.B31 J4.A31 J4.B31
BUS_I2C1_SDA
  Top 0.2: J4.B30 J4.A30 J3.B30 J3.A30 J2.B30 J2.A30 J1.B30 J1.A30 J0.B30 J0.A30
BUS_JTAG_EN-0
  Bottom 0.2: J4.B46 9.65,52.95 9.85,52.75 9.85,51.75 8.85,50.75 8.85,49.52 3.7,44.37 3.7,41.63 9.58,35.75 J3.B46 9.65,31.95 9.85,31.75 9.85,30.75 8.85,29.75 8.85,28.92 9.65,28.12 J2.B46 9.65,22.95 9.85,22.75 9.85,21.75 8.85,20.75 8.85,19.92 9.65,19.12 J1.B46 9.65,13.95 9.85,13.75 9.85,12.75 8.85,11.75 8.85,10.92 9.65,10.12 J0.B46
BUS_JTAG_EN-1
  Bottom 0.2: J4.B47 8.65,53.38 9.45,52.58 9.45,51.92 8.45,50.92 8.45,49.68 3.3,44.53 3.3,41.47 8.65,36.12 J3.B47 8.65,32.38 9.45,31.58 9.45,30.92 8.45,29.92 8.45,28.75 8.65,28.55 J2.B47 8.65,23.38 9.45,22.58 9.45,21.92 8.45,20.92 8.45,19.75 8.65,19.55 J1.B47 8.65,14.38 9.45,13.58 9.45,12.92 8.45,11.92 8.45,10.75 8.65,10.55 J0.B47
BUS_JTAG_EN-2
  Bottom 0.2: J4.B48 7.65,52.95 7.85,52.75 7.85,51.75 6.85,50.75 6.85,48.65 2.9,44.7 2.9,41.3 7.65,36.55 J3.B48 7.65,31.95 7.85,31.75 7.85,30.75 6.85,29.75 6.85,28.92 7.65,28.12 J2.B48 7.65,22.95 7.85,22.75 7.85,21.75 6.85,20.75 6.85,19.92 7.32,19.45 7.4,19.45 7.65,19.2 J1.B48 7.65,13.95 7.85,13.75 7.85,12.75 6.85,11.75 6.85,10.92 7.65,10.12 J0.B48
BUS_JTAG_EN-3
  Bottom 0.2: J4.B49 6.65,53.38 7.45,52.58 7.45,51.92 6.45,50.92 6.45,48.81 2.5,44.86 2.5,41.14 6.65,36.99 J3.B49 6.65,32.38 7.45,31.58 7.45,30.92 6.45,29.92 6.45,28.75 6.65,28.55 J2.B49 6.65,23.38 7.45,22.58 7.45,21.92 6.45,20.92 6.45,19.75 6.65,19.55 J1.B49 6.65,14.38 7.45,13.58 7.45,12.92 6.45,11.92 6.45,10.75 6.65,10.55 J0.B49
BUS_JTAG_TCK
  Top 0.2: J4.A46 9.58,50.25 3.7,44.37 3.7,41.63 8.85,36.48 8.85,35.42 9.85,34.42 9.85,33.25 9.65,33.05 J3.A46 9.65,27.88 8.85,27.08 8.85,26.42 9.85,25.42 9.85,24.25 9.65,24.05 J2.A46 9.65,18.88 8.85,18.08 8.85,17.42 9.85,16.42 9.85,15.25 9.65,15.05 J1.A46 9.65,9.88 8.85,9.08 8.85,8.42 9.85,7.42 9.85,6.25 9.65,6.05 J0.A46
BUS_JTAG_TDI
  Top 0.2: J4.A47 8.65,49.88 3.3,44.53 3.3,41.47 8.45,36.32 8.45,35.25 9.45,34.25 9.45,33.42 8.65,32.62 J3.A47 8.65,27.45 8.45,27.25 8.45,26.25 9.45,25.25 9.45,24.42 8.65,23.62 J2.A47 8.65,18.45 8.45,18.25 8.45,17.25 9.45,16.25 9.45,15.42 8.65,14.62 J1.A47 8.65,9.45 8.45,9.25 8.45,8.25 9.45,7.25 9.45,6.42 8.65,5.62 J0.A47
BUS_JTAG_TDO
  Top 0.2: J0.A48 7.65,6.05 7.85,6.25 7.85,7.42 6.85,8.42 6.85,9.08 7.65,9.88 J1.A48 7.65,15.05 7.85,15.25 7.85,16.42 6.85,17.42 6.85,18.08 7.65,18.88 J2.A48 7.65,24.05 7.85,24.25 7.85,25.42 6.85,26.42 6.85,27.08 7.65,27.88 J3.A48 7.65,33.05 7.85,33.25 7.85,34.25 6.85,35.25 6.85,37.35 2.9,41.3 2.9,44.7 7.65,49.45 J4.A48
BUS_JTAG_TMS
  Top 0.2: J0.A49 6.65,5.62 7.45,6.42 7.45,7.25 6.45,8.25 6.45,9.25 6.65,9.45 J1.A49 6.65,14.62 7.45,15.42 7.45,16.25 6.45,17.25 6.45,18.25 6.65,18.45 J2.A49 6.65,23.62 7.45,24.42 7.45,25.25 6.45,26.25 6.45,27.25 6.65,27.45 J3.A49 6.65,32.62 7.45,33.42 7.45,34.08 6.45,35.08 6.45,37.19 2.5,41.14 2.5,44.86 6.65,49.01 J4.A49
BUS_SPI_MISO
  Top 0.2: J0.A38 J0.B38 J1.A38 J1.B38 J2.A38 J2.B38 J3.A38 J3.B38 J4.A38 J4.B38
BUS_SPI_MOSI
  Top 0.2: J4.B39 J4.A39 J3.B39 J3.A39 J2.B39 J2.A39 J1.B39 J1.A39 J0.B39 J0.A39
BUS_SPI_SCK
  Top 0.2: J4.B37 J4.A37 J3.B37 J3.A37 J2.B37 J2.A37 J1.B37 J1.A37 J0.B37 J0.A37
CHASSIS1
  Top 0.2: H1.1 H1.V1 | 7.51,43 H1.V7 | H1.1 7.51,43 | 7.51,43 H1.V5 | 7,41.52 H1.V4 | H1.1 7,41.52 | 7,41.52 H1.V3 | 6.49,43 H1.V2 | H1.1 6.49,43 | 6.49,43 H1.V10 | 7,44.48 H1.V9 | H1.1 7,44.48 | 7,44.48 H1.V8
  Top 0.68: C1.1 11.5,42.4 | 11.5,42.4 R1.2 11.5,43.6 10.9,43 | H1.1 10.9,43 | 10.9,43 11.5,42.4
  Bottom 0.68: H1.1 H1.V6
CHASSIS2
  Top 0.2: 34.49,43 H2.V10 | H2.1 34.49,43 | 34.49,43 H2.V2 | 35,41.52 H2.V3 | H2.1 35,41.52 | 35,41.52 H2.V4 | H2.1 H2.V6 | 35.51,43 H2.V5 | H2.1 35.51,43 | 35.51,43 H2.V7 | 35,44.48 H2.V8 | H2.1 35,44.48 | 35,44.48 H2.V9
  Top 0.68: H2.1 31.1,43 | 31.1,43 30.5,43.6 R2.2 C2.1 30.5,42.4 31.1,43
  Bottom 0.68: H2.1 H2.V1
COM_SPI_CS
  Top 0.2: J0.A36 J0.B36 J1.A36 J1.B36 J2.A36 J2.B36 J3.A36 J3.B36 J4.A36 J4.B36
COM_SPI_MISO
  Top 0.2: J4.B34 J4.A34 J3.B34 J3.A34 J2.B34 J2.A34 J1.B34 J1.A34 J0.B34 J0.A34
COM_SPI_MOSI
  Top 0.2: J4.B35 J4.A35 J3.B35 J3.A35 J2.B35 J2.A35 J1.B35 J1.A35 J0.B35 J0.A35
COM_SPI_SCK
  Top 0.2: J0.A33 J0.B33 J1.A33 J1.B33 J2.A33 J2.B33 J3.A33 J3.B33 J4.A33 J4.B33
CTRL_SYNC
  Top 0.2: J0.A42 J0.B42 J1.A42 J1.B42 J2.A42 J2.B42 J3.A42 J3.B42 13.65,42.03 14.25,42.63 14.25,43.37 13.65,43.97 J4.A42 J4.B42
GPIO-0
  Top 0.2: J4.A24 28.45,47.05 28.45,38.65 30.85,36.25 30.85,35.25 31.85,34.25 31.85,33.25 31.65,33.05 J3.A24 31.65,27.88 30.85,27.08 30.85,26.42 31.85,25.42 31.85,24.25 31.65,24.05 J2.A24 31.65,18.88 30.85,18.08 30.85,17.42 31.85,16.42 31.85,15.25 31.65,15.05 J1.A24 31.65,9.88 30.85,9.08 30.85,8.42 31.85,7.42 31.85,6.25 31.65,6.05 J0.A24
GPIO-1
  Top 0.2: J4.A25 30.65,50.12 28.05,47.52 28.05,38.48 30.45,36.08 30.45,35.08 31.45,34.08 31.45,33.42 30.65,32.62 J3.A25 30.65,27.45 30.45,27.25 30.45,26.25 31.45,25.25 31.45,24.42 30.65,23.62 J2.A25 30.65,18.45 30.45,18.25 30.45,17.25 31.45,16.25 31.45,15.42 30.65,14.62 J1.A25 30.65,9.45 30.45,9.25 30.45,8.25 31.45,7.25 31.45,6.42 30.65,5.62 J0.A25
GPIO-2
  Top 0.2: J4.A26 27.65,48.25 27.65,37.45 28.85,36.25 28.85,35.25 29.85,34.25 29.85,33.25 29.65,33.05 J3.A26 29.65,27.88 28.85,27.08 28.85,26.42 29.85,25.42 29.85,24.25 29.65,24.05 J2.A26 29.65,18.88 28.85,18.08 28.85,17.42 29.85,16.42 29.85,15.25 29.65,15.05 J1.A26 29.65,9.88 28.85,9.08 28.85,8.42 29.85,7.42 29.85,6.25 29.65,6.05 J0.A26
GPIO-3
  Top 0.2: J4.A27 28.65,50.12 27.25,48.72 27.25,37.28 28.45,36.08 28.45,35.08 29.45,34.08 29.45,33.42 28.65,32.62 J3.A27 28.65,27.45 28.45,27.25 28.45,26.25 29.45,25.25 29.45,24.42 28.65,23.62 J2.A27 28.65,18.45 28.45,18.25 28.45,17.25 29.45,16.25 29.45,15.42 28.65,14.62 J1.A27 28.65,9.45 28.45,9.25 28.45,8.25 29.45,7.25 29.45,6.42 28.65,5.62 J0.A27
GPIO-4
  Top 0.2: J4.A28 26.85,49.45 26.85,35.25 27.85,34.25 27.85,33.25 27.65,33.05 J3.A28 27.65,27.88 26.85,27.08 26.85,26.42 27.85,25.42 27.85,24.25 27.65,24.05 J2.A28 27.65,18.88 26.85,18.08 26.85,17.42 27.85,16.42 27.85,15.25 27.65,15.05 J1.A28 27.65,9.88 26.85,9.08 26.85,8.42 27.85,7.42 27.85,6.25 27.65,6.05 J0.A28
GPIO-5
  Top 0.2: J4.A29 26.45,52.05 26.45,35.08 27.45,34.08 27.45,33.42 26.65,32.62 J3.A29 26.65,27.45 26.45,27.25 26.45,26.25 27.45,25.25 27.45,24.42 26.65,23.62 J2.A29 26.65,18.45 26.45,18.25 26.45,17.25 27.45,16.25 27.45,15.42 26.65,14.62 J1.A29 26.65,9.45 26.45,9.25 26.45,8.25 27.45,7.25 27.45,6.42 26.65,5.62 J0.A29
GPIO-6
  Top 0.2: J0.A41 14.65,5.62 15.45,6.42 15.45,7.08 14.65,7.88 J1.A41 14.65,14.62 15.45,15.42 15.45,16.08 14.65,16.88 J2.A41 14.65,23.62 15.45,24.42 15.45,25.08 14.85,25.68 14.85,31.05 J3.A41 14.65,32.62 15.45,33.42 15.45,34.08 14.85,34.68 14.85,36.35 14.65,36.55 J4.A41
GPIO-7
  Bottom 0.2: J4.B41 14.65,53.38 15.45,52.58 15.45,51.55 14.65,50.75 14.65,50 13.05,48.4 13.05,37.48 14.65,35.88 J3.B41 14.65,32.38 15.45,31.58 15.45,30.92 14.65,30.12 J2.B41 14.65,23.38 15.45,22.58 15.45,21.92 14.65,21.12 J1.B41 14.65,14.38 15.45,13.58 15.45,12.92 14.65,12.12 J0.B41
PGND  (via drill 0.3)
  Top 0.2: J3.B22 33.65,38.15 31.35,40.45 C2.2 | J4.A22 33.65,47.85 31.35,45.55 R2.1 | R1.1 13.65,43.4 v13.65,43 13.65,42.6 C1.2
  Bottom 0.2: J4.A22 33.65,46.32 31.7,44.37 31.7,43 | 31.7,43 31.7,41.63 33.65,39.68 J3.B22 | 31.7,43 v13.65,43
  Bottom 0.26: J3.B29 J3.B27 J3.B25 J3.B23 J3.B21 | J3.B21 34.65,34.75 J3.B22 J3.B24 J3.B26 J3.B28 | J3.B21 J3.A21 | J3.A21 34.65,30.25 J3.A22 J2.B22 | J3.A23 J3.A21 | J2.B22 34.65,25.75 J2.B21 | J2.B21 J2.A21 | J2.A21 34.65,21.25 J2.A22 J1.B22 | J1.B22 34.65,16.75 J1.B21 | J1.B21 J1.A21 | J1.A21 34.65,12.25 J1.A22 J0.B22 | J0.B22 34.65,7.75 J0.B21 | J0.B21 J0.A21 | J0.A21 34.65,3.25 J0.A22 | J0.A23 J0.A21 | J0.B21 J0.B23 J0.B25 J0.B27 J0.B29 | J0.B28 J0.B26 J0.B24 J0.B22 | J1.A21 J1.A23 | J1.B21 J1.B23 J1.B25 J1.B27 J1.B29 | J1.B28 J1.B26 J1.B24 J1.B22 | J2.A21 J2.A23 | J2.B21 J2.B23 J2.B25 J2.B27 J2.B29 | J2.B28 J2.B26 J2.B24 J2.B22 | J4.A22 34.65,51.25 J4.A21 | J4.B21 34.65,55.75 J4.B22 J4.B24 J4.B26 J4.B28 | J4.A21 J4.A23 | J4.B21 J4.B23 J4.B25 J4.B27 J4.B29 | J4.B21 J4.A21
  pour Bottom: 35,1.9 26.3,1.9 26.3,35.9 25.2,37 25.2,49 26.2,50 26.2,57.1 35,57.1
  pour Top: 35,1.9 31.65,1.9 31.65,35.46 28.54,38.57 28.54,47.14 31.65,50.25 31.65,57.1 35,57.1
PR_3.3V-0
  Top 0.6: J4.B1 J4.A1 J3.B1 J3.A1 J2.B1 J2.A1 J1.B1 J1.A1 J0.B1 J0.A1
  Bottom 0.6: J0.A1 J0.B1 J1.A1 J1.B1 J2.A1 J2.B1 J3.A1 J3.B1 J4.A1 J4.B1
PR_3.3V-1
  Top 0.6: J4.B2 J4.A2 J3.B2 J3.A2 J2.B2 J2.A2 J1.B2 J1.A2 J0.B2 J0.A2
  Bottom 0.6: J0.A2 J0.B2 J1.A2 J1.B2 J2.A2 J2.B2 J3.A2 J3.B2 J4.A2 J4.B2
PR_3.3V-2
  Top 0.6: J4.B3 J4.A3 J3.B3 J3.A3 J2.B3 J2.A3 J1.B3 J1.A3 J0.B3 J0.A3
  Bottom 0.6: J0.A3 J0.B3 J1.A3 J1.B3 J2.A3 J2.B3 J3.A3 J3.B3 J4.A3 J4.B3
PR_3.3V-3
  Top 0.6: J4.B4 J4.A4 J3.B4 J3.A4 J2.B4 J2.A4 J1.B4 J1.A4 J0.B4 J0.A4
  Bottom 0.6: J0.A4 J0.B4 J1.A4 J1.B4 J2.A4 J2.B4 J3.A4 J3.B4 J4.A4 J4.B4
PR_3.3V-4
  Top 0.6: J4.B5 J4.A5 J3.B5 J3.A5 J2.B5 J2.A5 J1.B5 J1.A5 J0.B5 J0.A5
  Bottom 0.6: J0.A5 J0.B5 J1.A5 J1.B5 J2.A5 J2.B5 J3.A5 J3.B5 J4.A5 J4.B5
PR_3.3V-5
  Top 0.6: J4.B6 J4.A6 J3.B6 J3.A6 J2.B6 J2.A6 J1.B6 J1.A6 J0.B6 J0.A6
  Bottom 0.6: J0.A6 J0.B6 J1.A6 J1.B6 J2.A6 J2.B6 J3.A6 J3.B6 J4.A6 J4.B6
PR_3.3V-6
  Top 0.6: J4.B7 J4.A7 J3.B7 J3.A7 J2.B7 J2.A7 J1.B7 J1.A7 J0.B7 J0.A7
  Bottom 0.6: J0.A7 J0.B7 J1.A7 J1.B7 J2.A7 J2.B7 J3.A7 J3.B7 J4.A7 J4.B7
PR_3.3V-7
  Top 0.6: J4.B8 J4.A8 J3.B8 J3.A8 J2.B8 J2.A8 J1.B8 J1.A8 J0.B8 J0.A8
  Bottom 0.6: J0.A8 J0.B8 J1.A8 J1.B8 J2.A8 J2.B8 J3.A8 J3.B8 J4.A8 J4.B8
PR_3.3V-8
  Top 0.6: J4.B9 J4.A9 J3.B9 J3.A9 J2.B9 J2.A9 J1.B9 J1.A9 J0.B9 J0.A9
  Bottom 0.6: J0.A9 J0.B9 J1.A9 J1.B9 J2.A9 J2.B9 J3.A9 J3.B9 J4.A9 J4.B9
PR_3.3V-9
  Top 0.6: J0.A10 J0.B10 J1.A10 J1.B10 J2.A10 J2.B10 J3.A10 J3.B10 J4.A10 J4.B10
  Bottom 0.6: J0.A10 J0.B10 J1.A10 J1.B10 J2.A10 J2.B10 J3.A10 J3.B10 J4.A10 J4.B10
PR_3.3V-10
  Top 0.6: J4.B11 46.65,54.41 46.81,54.25 46.81,52.75 46.65,52.59 J4.A11 J3.B11 46.65,33.41 46.81,33.25 46.81,31.75 46.65,31.59 J3.A11 J2.B11 46.65,24.41 46.81,24.25 46.81,22.75 46.65,22.59 J2.A11 J1.B11 46.65,15.41 46.81,15.25 46.81,13.75 46.65,13.59 J1.A11 J0.B11 46.65,6.41 46.81,6.25 46.81,4.75 46.65,4.59 J0.A11
  Bottom 0.6: J0.A11 46.65,4.59 46.81,4.75 46.81,6.25 46.65,6.41 J0.B11 J1.A11 46.65,13.59 46.81,13.75 46.81,15.25 46.65,15.41 J1.B11 J2.A11 46.65,22.59 46.81,22.75 46.81,24.25 46.65,24.41 J2.B11 J3.A11 46.65,31.59 46.81,31.75 46.81,33.25 46.65,33.41 J3.B11 J4.A11 46.65,52.59 46.81,52.75 46.81,54.25 46.65,54.41 J4.B11
PR_3.3V-11
  Top 0.6: J4.A12 J3.B12 | J0.B12 J1.A12 | J1.B12 J2.A12 | J2.B12 J3.A12
  Bottom 0.6: J3.B12 43.24,35.75 41.65,34.16 41.65,30.84 43.24,29.25 J3.A12 J2.B12 43.24,26.75 41.65,25.16 41.65,21.84 43.24,20.25 J2.A12 J1.B12 43.24,17.75 41.65,16.16 41.65,12.84 43.24,11.25 J1.A12 J0.B12 43.24,8.75 41.65,7.16 41.65,3.84 43.24,2.25 J0.A12 | J4.A12 43.24,50.25 41.65,51.84 41.65,55.16 43.24,56.75 J4.B12
PR_3.3V-12
  Top 0.6: J4.B13 J4.A13 J3.B13 J3.A13 J2.B13 J2.A13 J1.B13 J1.A13 J0.B13 J0.A13
  Bottom 0.6: J0.A13 J0.B13 | J1.A13 J1.B13 | J2.A13 J2.B13 | J3.A13 J3.B13 | J4.B13 J4.A13
PR_BATT-0
  Top 0.6: J4.B14 J4.A14 J3.B14 J3.A14 J2.B14 J2.A14 J1.B14 J1.A14 J0.B14 J0.A14
  Bottom 0.6: J0.B14 J1.A14 | J1.B14 J2.A14 | J2.B14 J3.A14
PR_BATT-1
  Top 0.6: J0.A15 J0.B15 J1.A15 J1.B15 J2.A15 J2.B15 J3.A15 J3.B15 J4.A15 J4.B15
  Bottom 0.6: J0.A15 J0.B15 J1.A15 J1.B15 J2.A15 J2.B15 J3.A15 J3.B15 | J4.A15 J4.B15
PR_BATT-2
  Top 0.6: J0.A16 J0.B16 J1.A16 J1.B16 J2.A16 J2.B16 J3.A16 J3.B16 J4.A16 J4.B16
  Bottom 0.6: J0.A16 J0.B16 J1.A16 J1.B16 J2.A16 J2.B16 J3.A16 J3.B16 | J4.A16 J4.B16
PR_BATT-3
  Top 0.6: J0.A17 J0.B17 J1.A17 J1.B17 J2.A17 J2.B17 J3.A17 J3.B17 J4.A17 J4.B17
  Bottom 0.6: J0.A17 J0.B17 J1.A17 J1.B17 J2.A17 J2.B17 J3.A17 J3.B17 | J4.B17 J4.A17
PR_BATT-4
  Top 0.6: J3.B18 J3.A18 J2.B18 J2.A18 J1.B18 J1.A18 J0.B18 J0.A18 | J4.B18 J4.A18
  Bottom 0.6: J0.A18 J0.B18 J1.A18 J1.B18 J2.A18 J2.B18 J3.A18 J3.B18 37.65,38.32 40.18,40.85 40.18,45.15 37.65,47.68 J4.A18 J4.B18
PR_BATT-5
  Top 0.6: J3.B19 J3.A19 J2.B19 J2.A19 J1.B19 J1.A19 J0.B19 J0.A19 | J4.B19 J4.A19
  Bottom 0.6: J0.A19 J0.B19 J1.A19 J1.B19 J2.A19 J2.B19 J3.A19 J3.B19 36.65,38.51 39.34,41.2 39.34,44.8 36.65,47.49 J4.A19 J4.B19
PR_BATT-6
  Top 0.6: J4.A20 J4.B20 | J3.B20 J3.A20 J2.B20 J2.A20 J1.B20 J1.A20 J0.B20 J0.A20
  Bottom 0.6: J0.A20 J0.B20 J1.A20 J1.B20 J2.A20 J2.B20 J3.A20 J3.B20 35.65,38.7 38.5,41.55 38.5,44.45 35.65,47.3 J4.A20 J4.B20
PWR_CTRL_SW
  Top 0.2: J4.B40 15.65,55.45 15.85,55.25 15.85,54.25 15.65,54.05 J4.A40 J3.B40 15.65,34.45 15.85,34.25 15.85,33.25 15.65,33.05 J3.A40 J2.B40 15.65,25.45 15.85,25.25 15.85,24.25 15.65,24.05 J2.A40 J1.B40 15.65,16.45 15.85,16.25 15.85,15.25 15.65,15.05 J1.A40 J0.B40 15.65,7.45 15.85,7.25 15.85,6.25 15.65,6.05 J0.A40

### Text on the board
tPlace: Slot 4 | Backplane V3.2 | Slot 3 | Slot 2 | Slot 1 | Slot 0